# EasyEDA schematic Generic_Agri_Node.json

## Sheets
1 Digital_IO: TITLE: GPIO; REV: 1.0; Date: 2021-01-21; Sheet: 1/1; Drawn By: GoRoNb; Company: agopengps.discourse.group
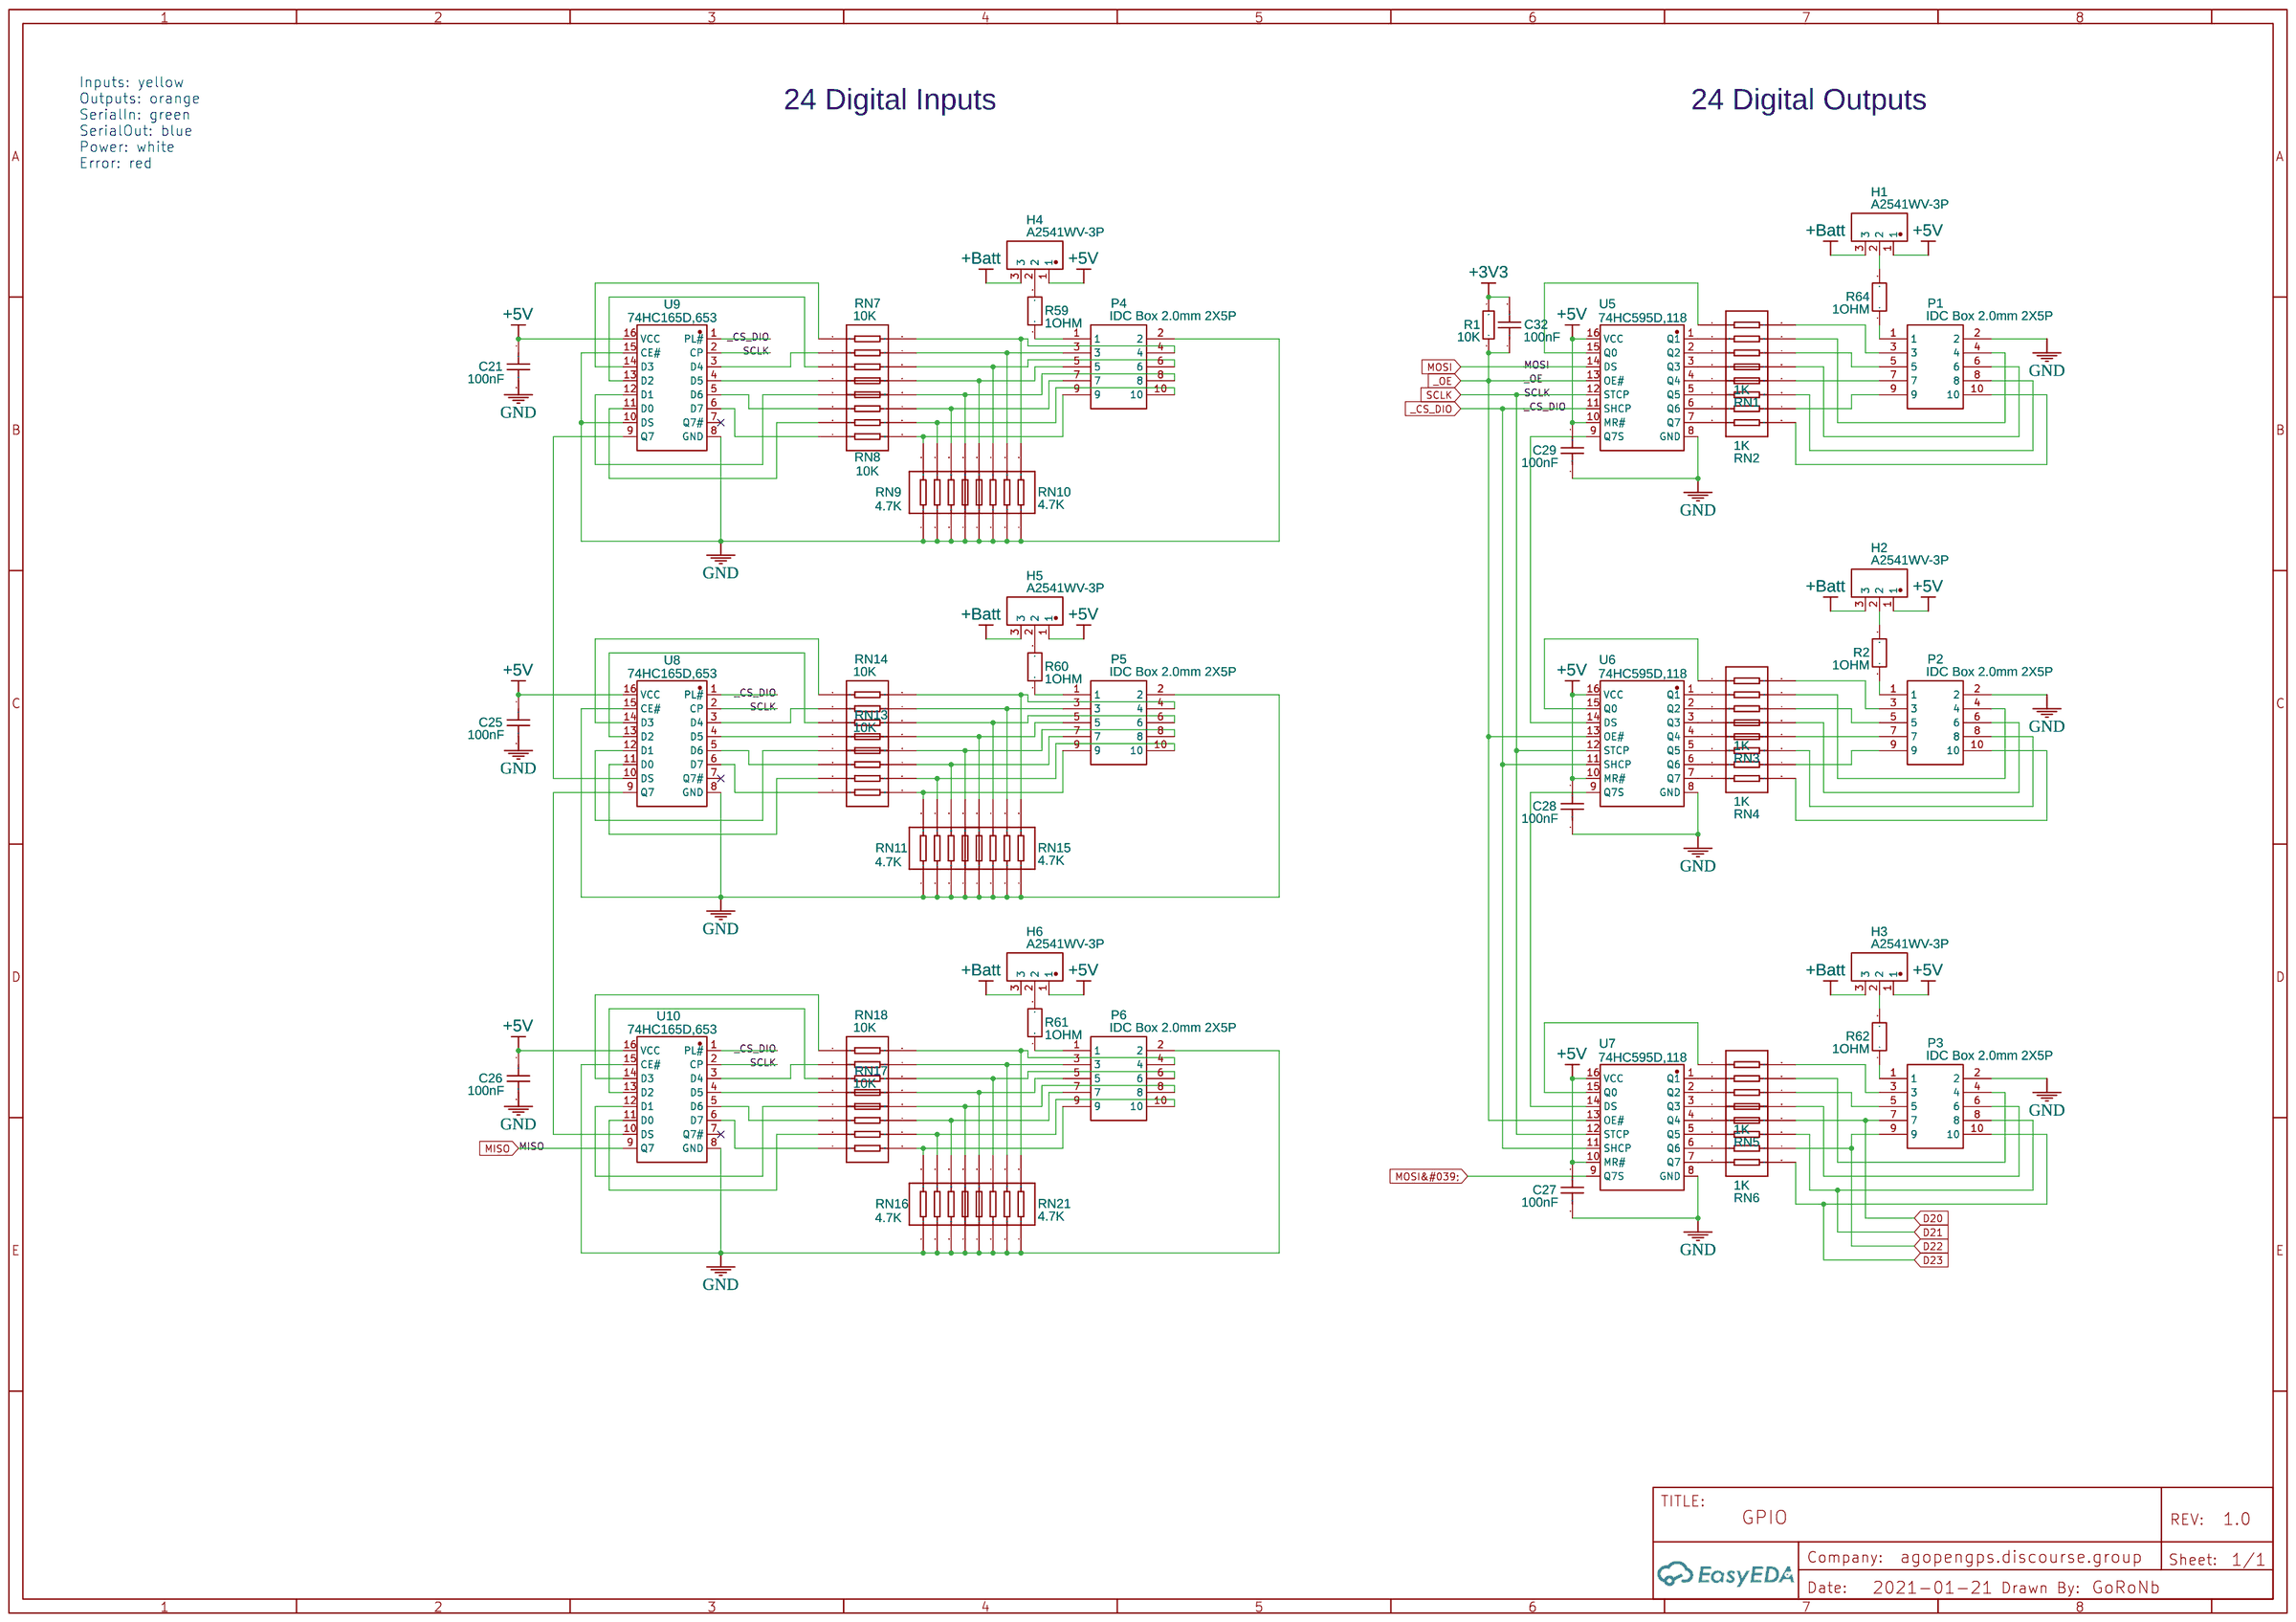
[diagram p0: Digital_IO]
2 Supply_Bus: TITLE: Supply & USB; Date: 2020-12-11
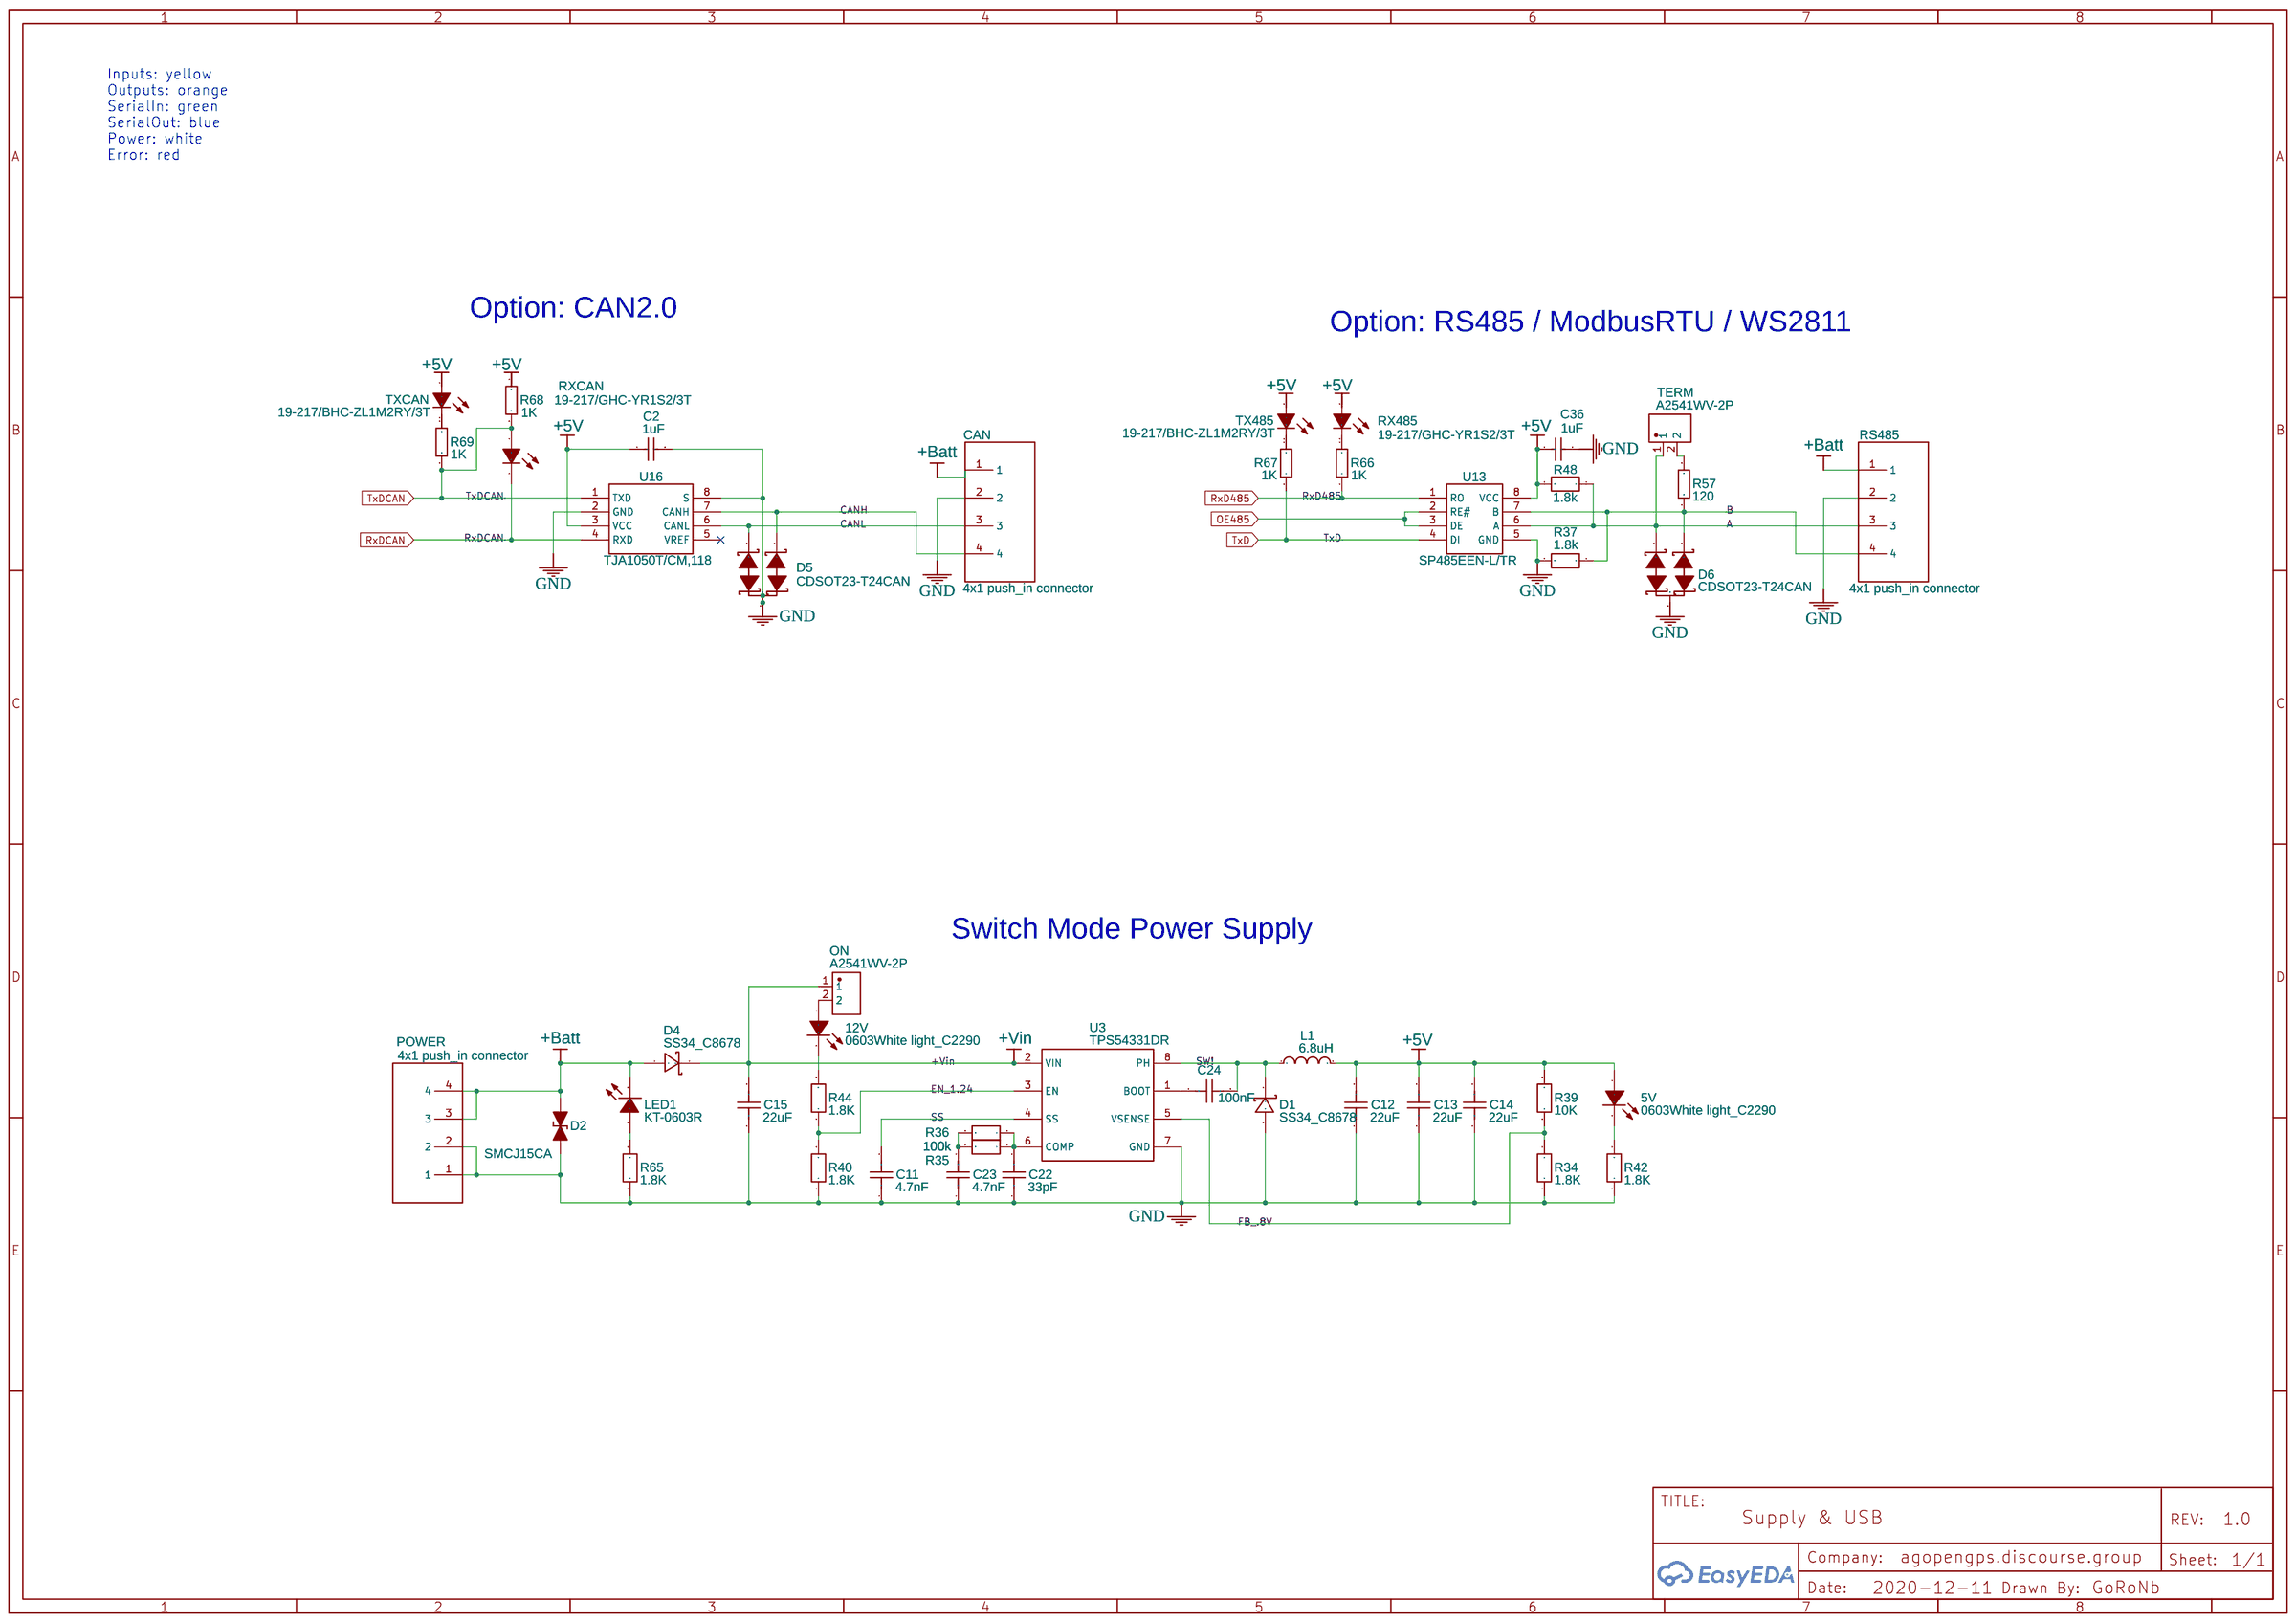
[diagram p1: Supply_Bus]
3 Analog_IO: TITLE: Analog I/O; Date: 2020-12-11
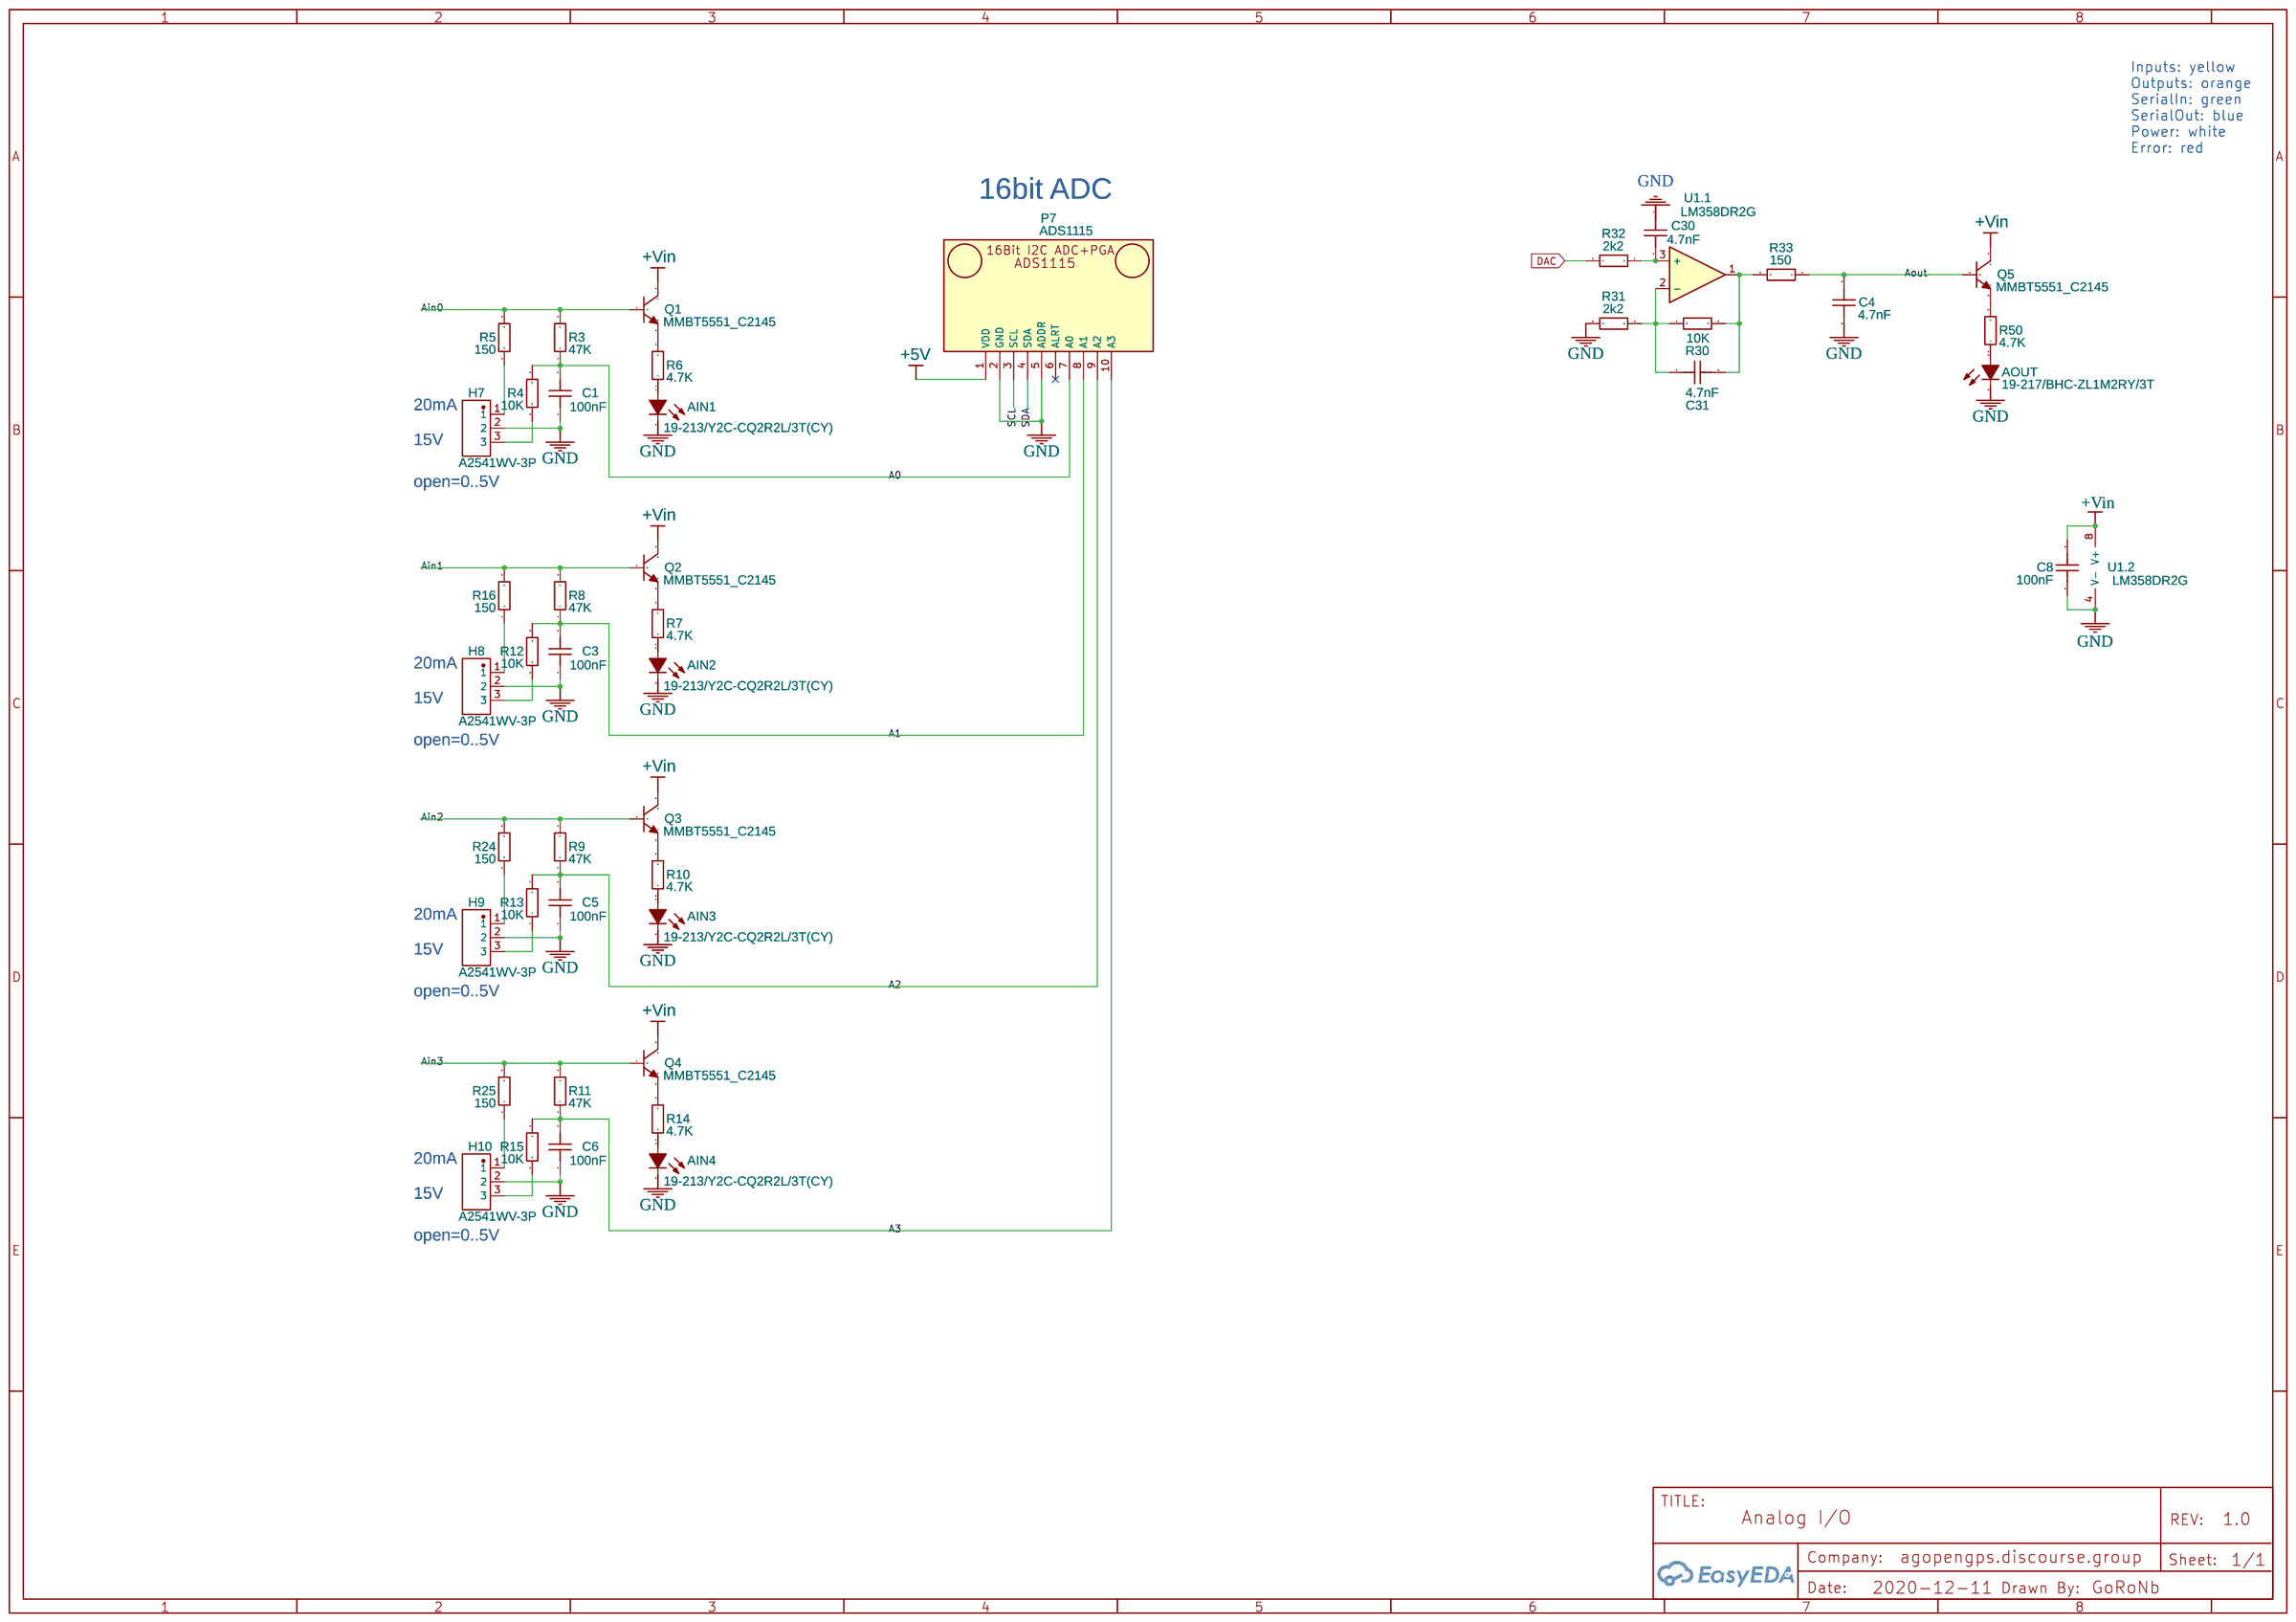
[diagram p2: Analog_IO]
4 Fast_IO: TITLE: Fast digital I/O
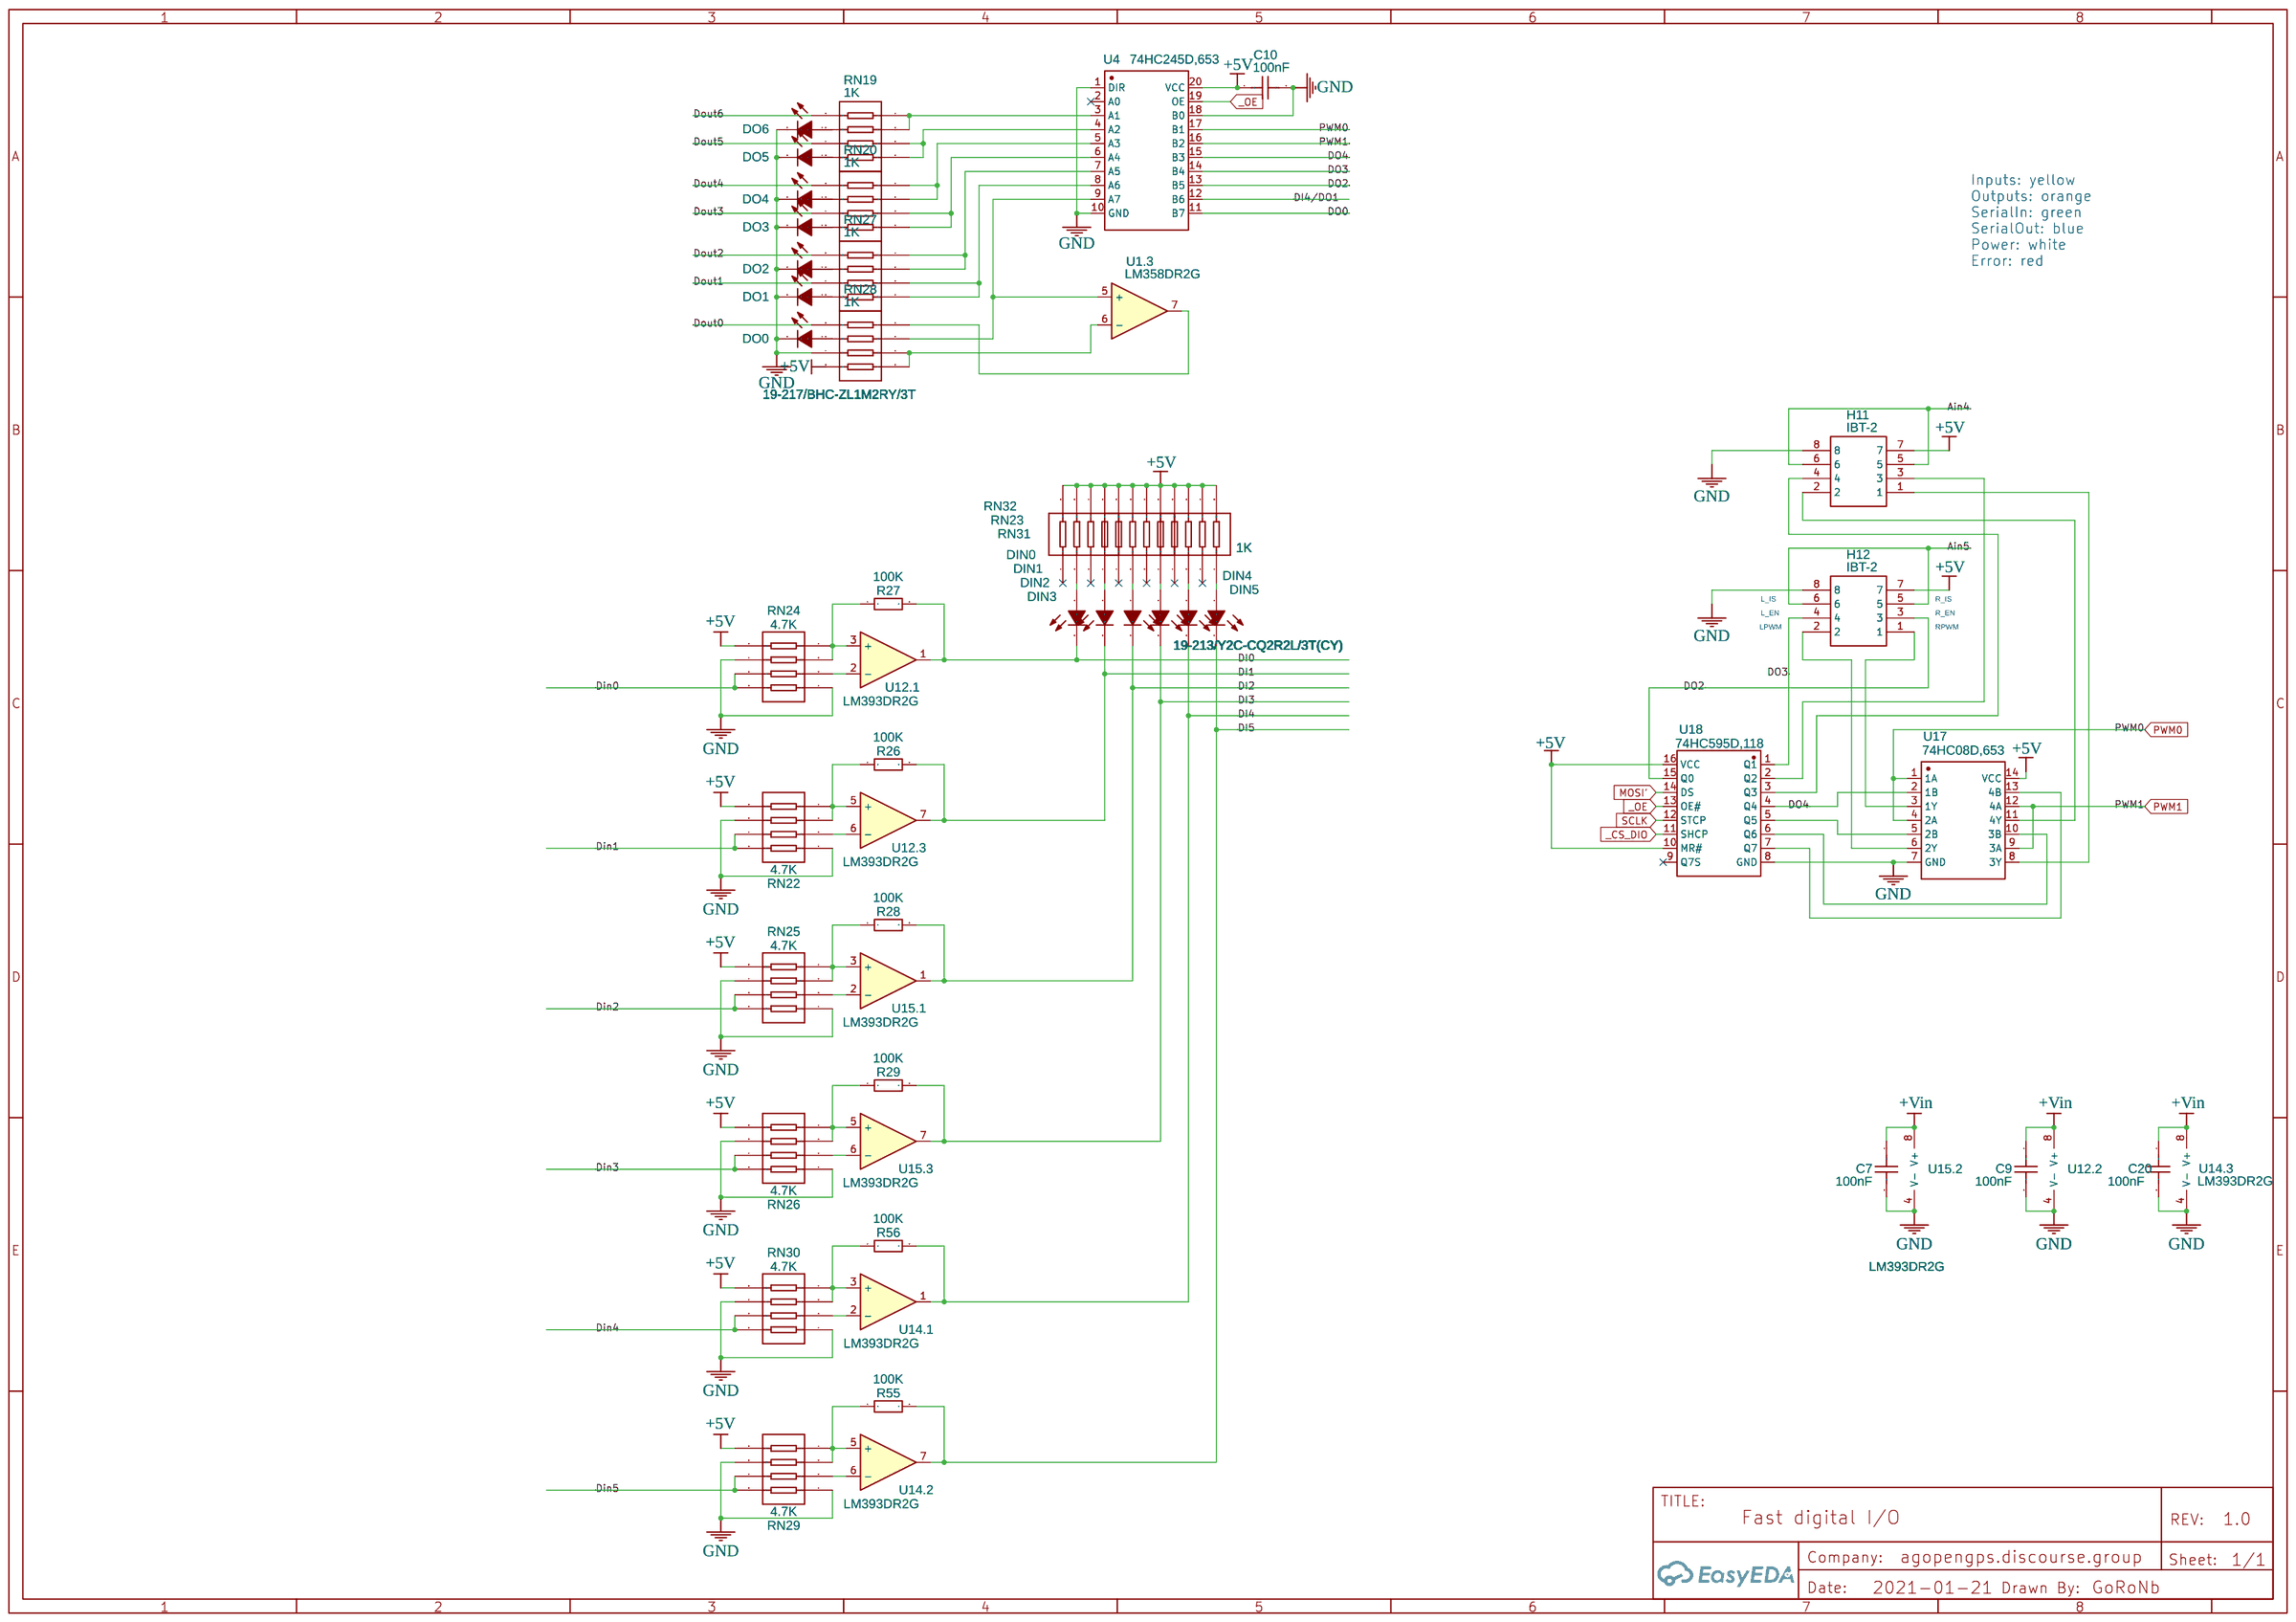
[diagram p3: Fast_IO]
5 Connectors: TITLE: Connectors; Date: 2020-12-11
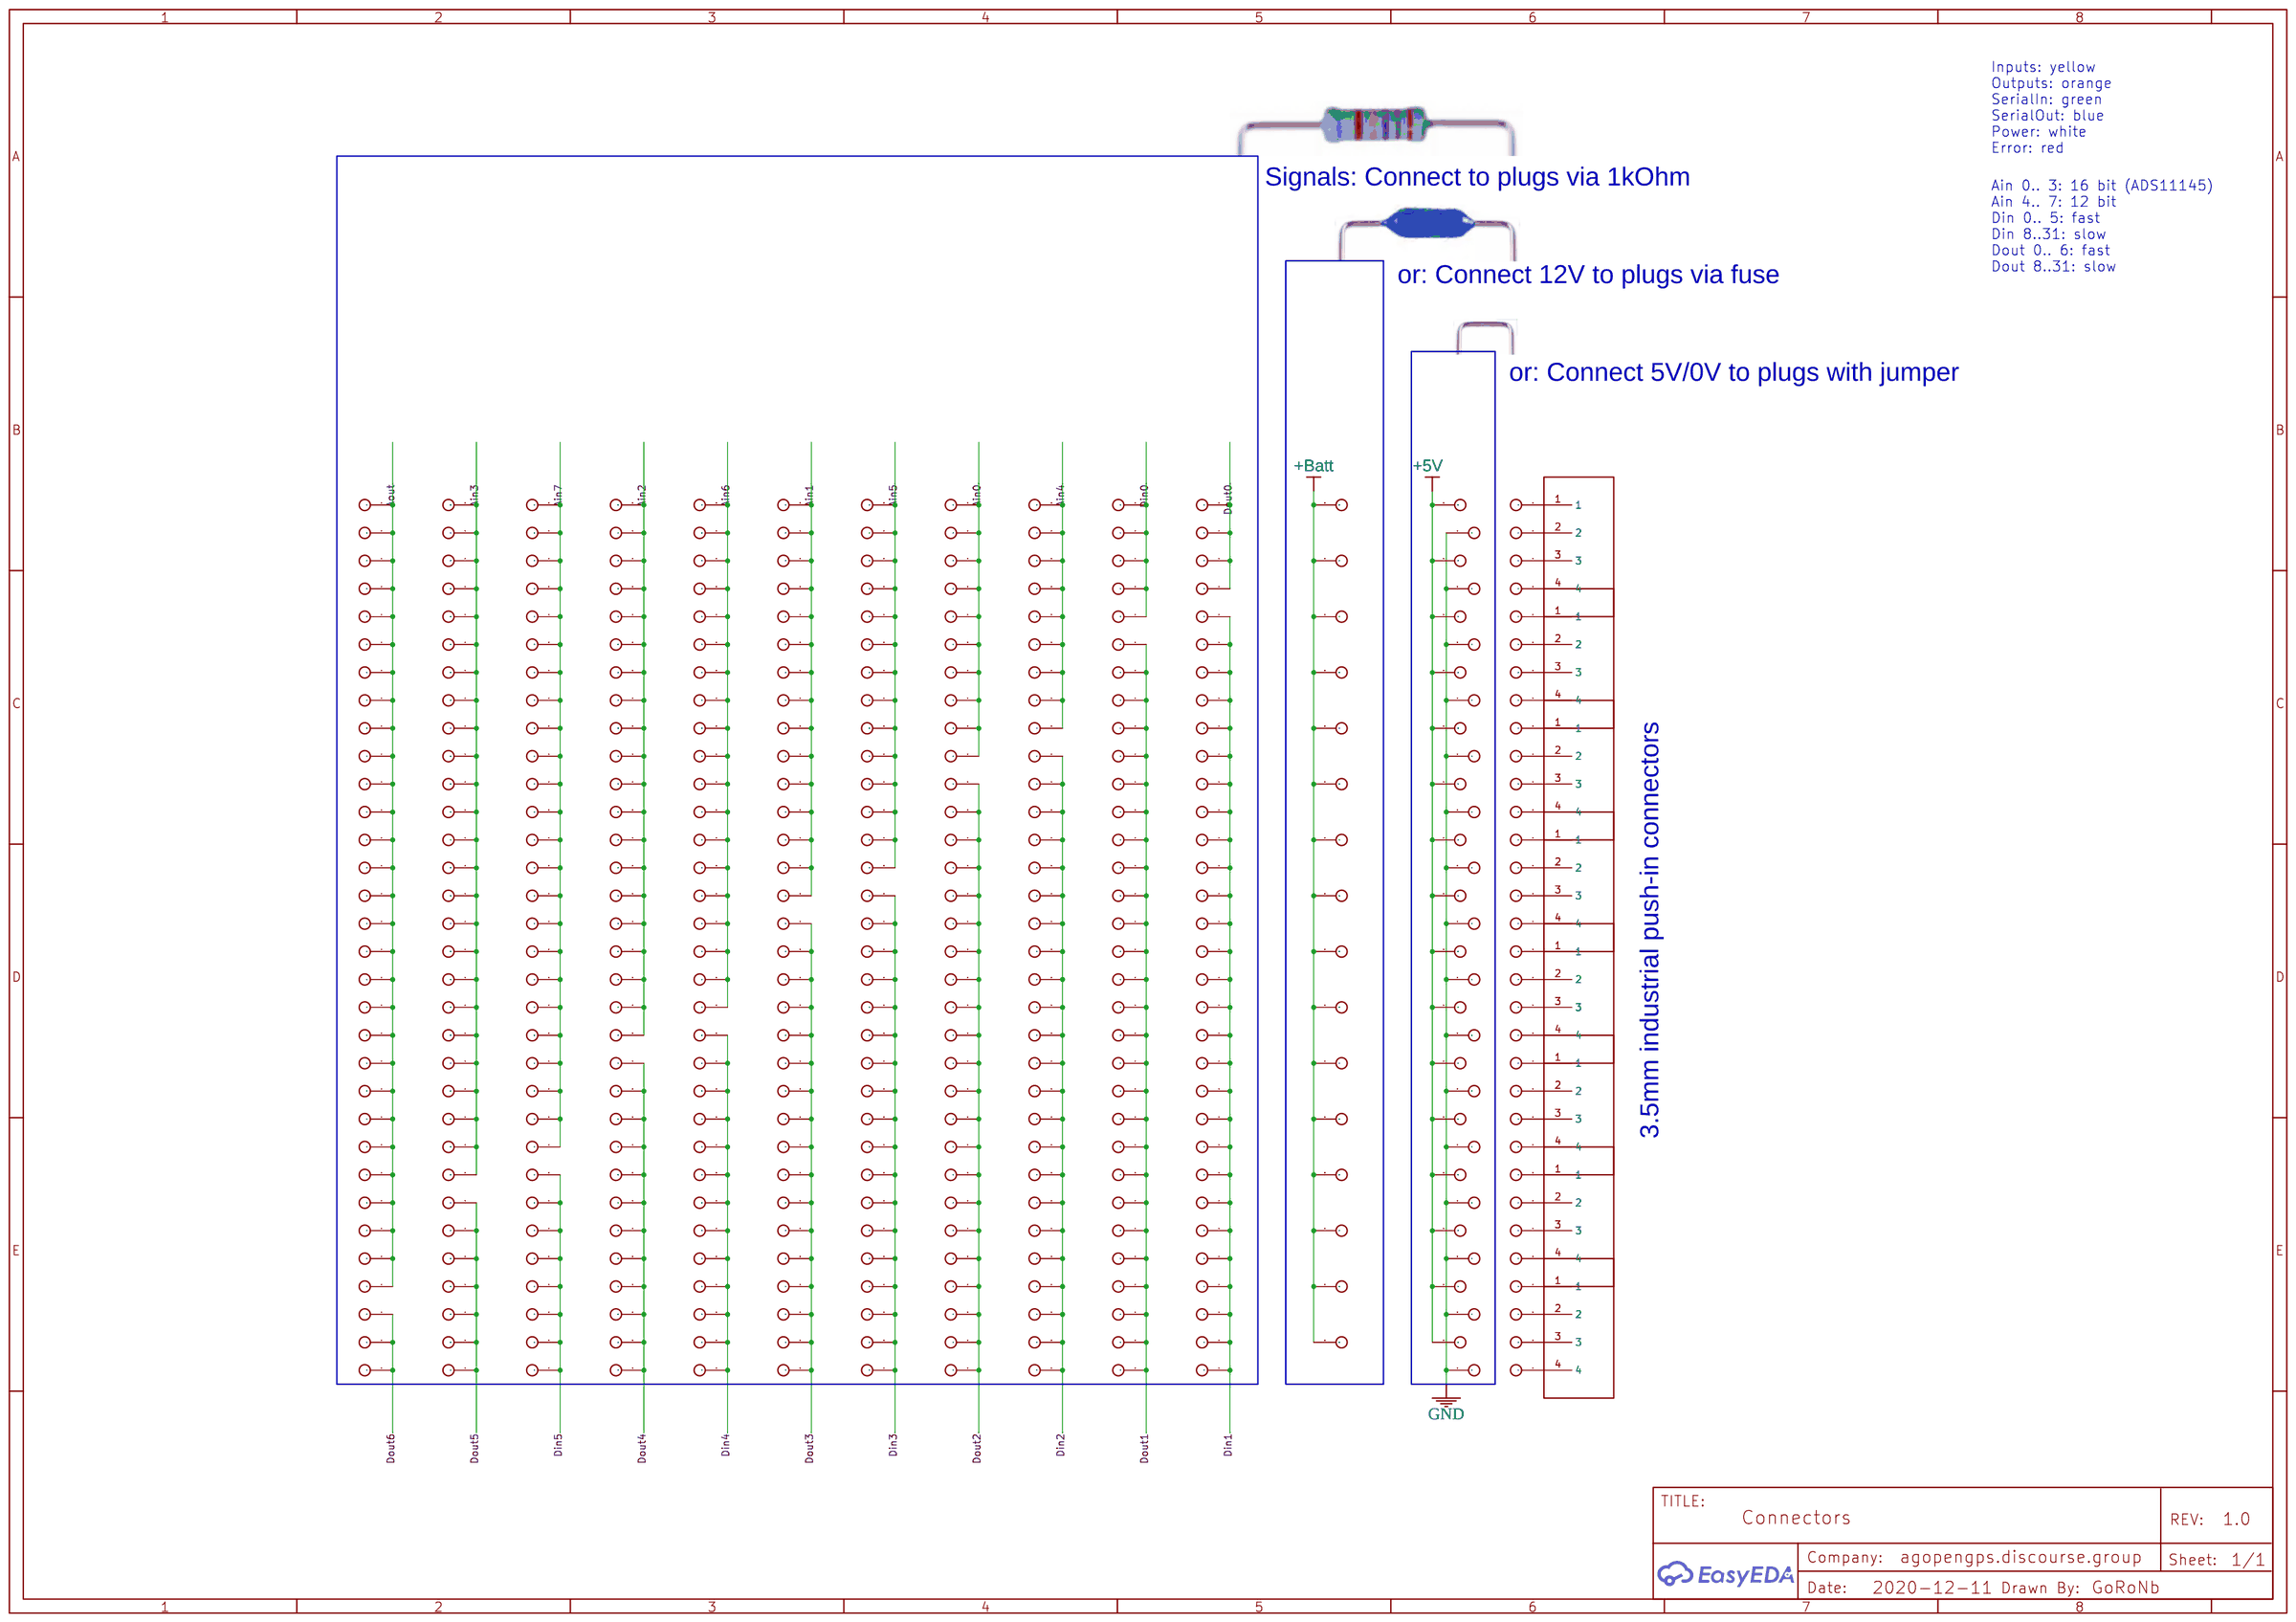
[diagram p4: Connectors]
6 µC: TITLE: µC, modules; Date: 2020-12-11
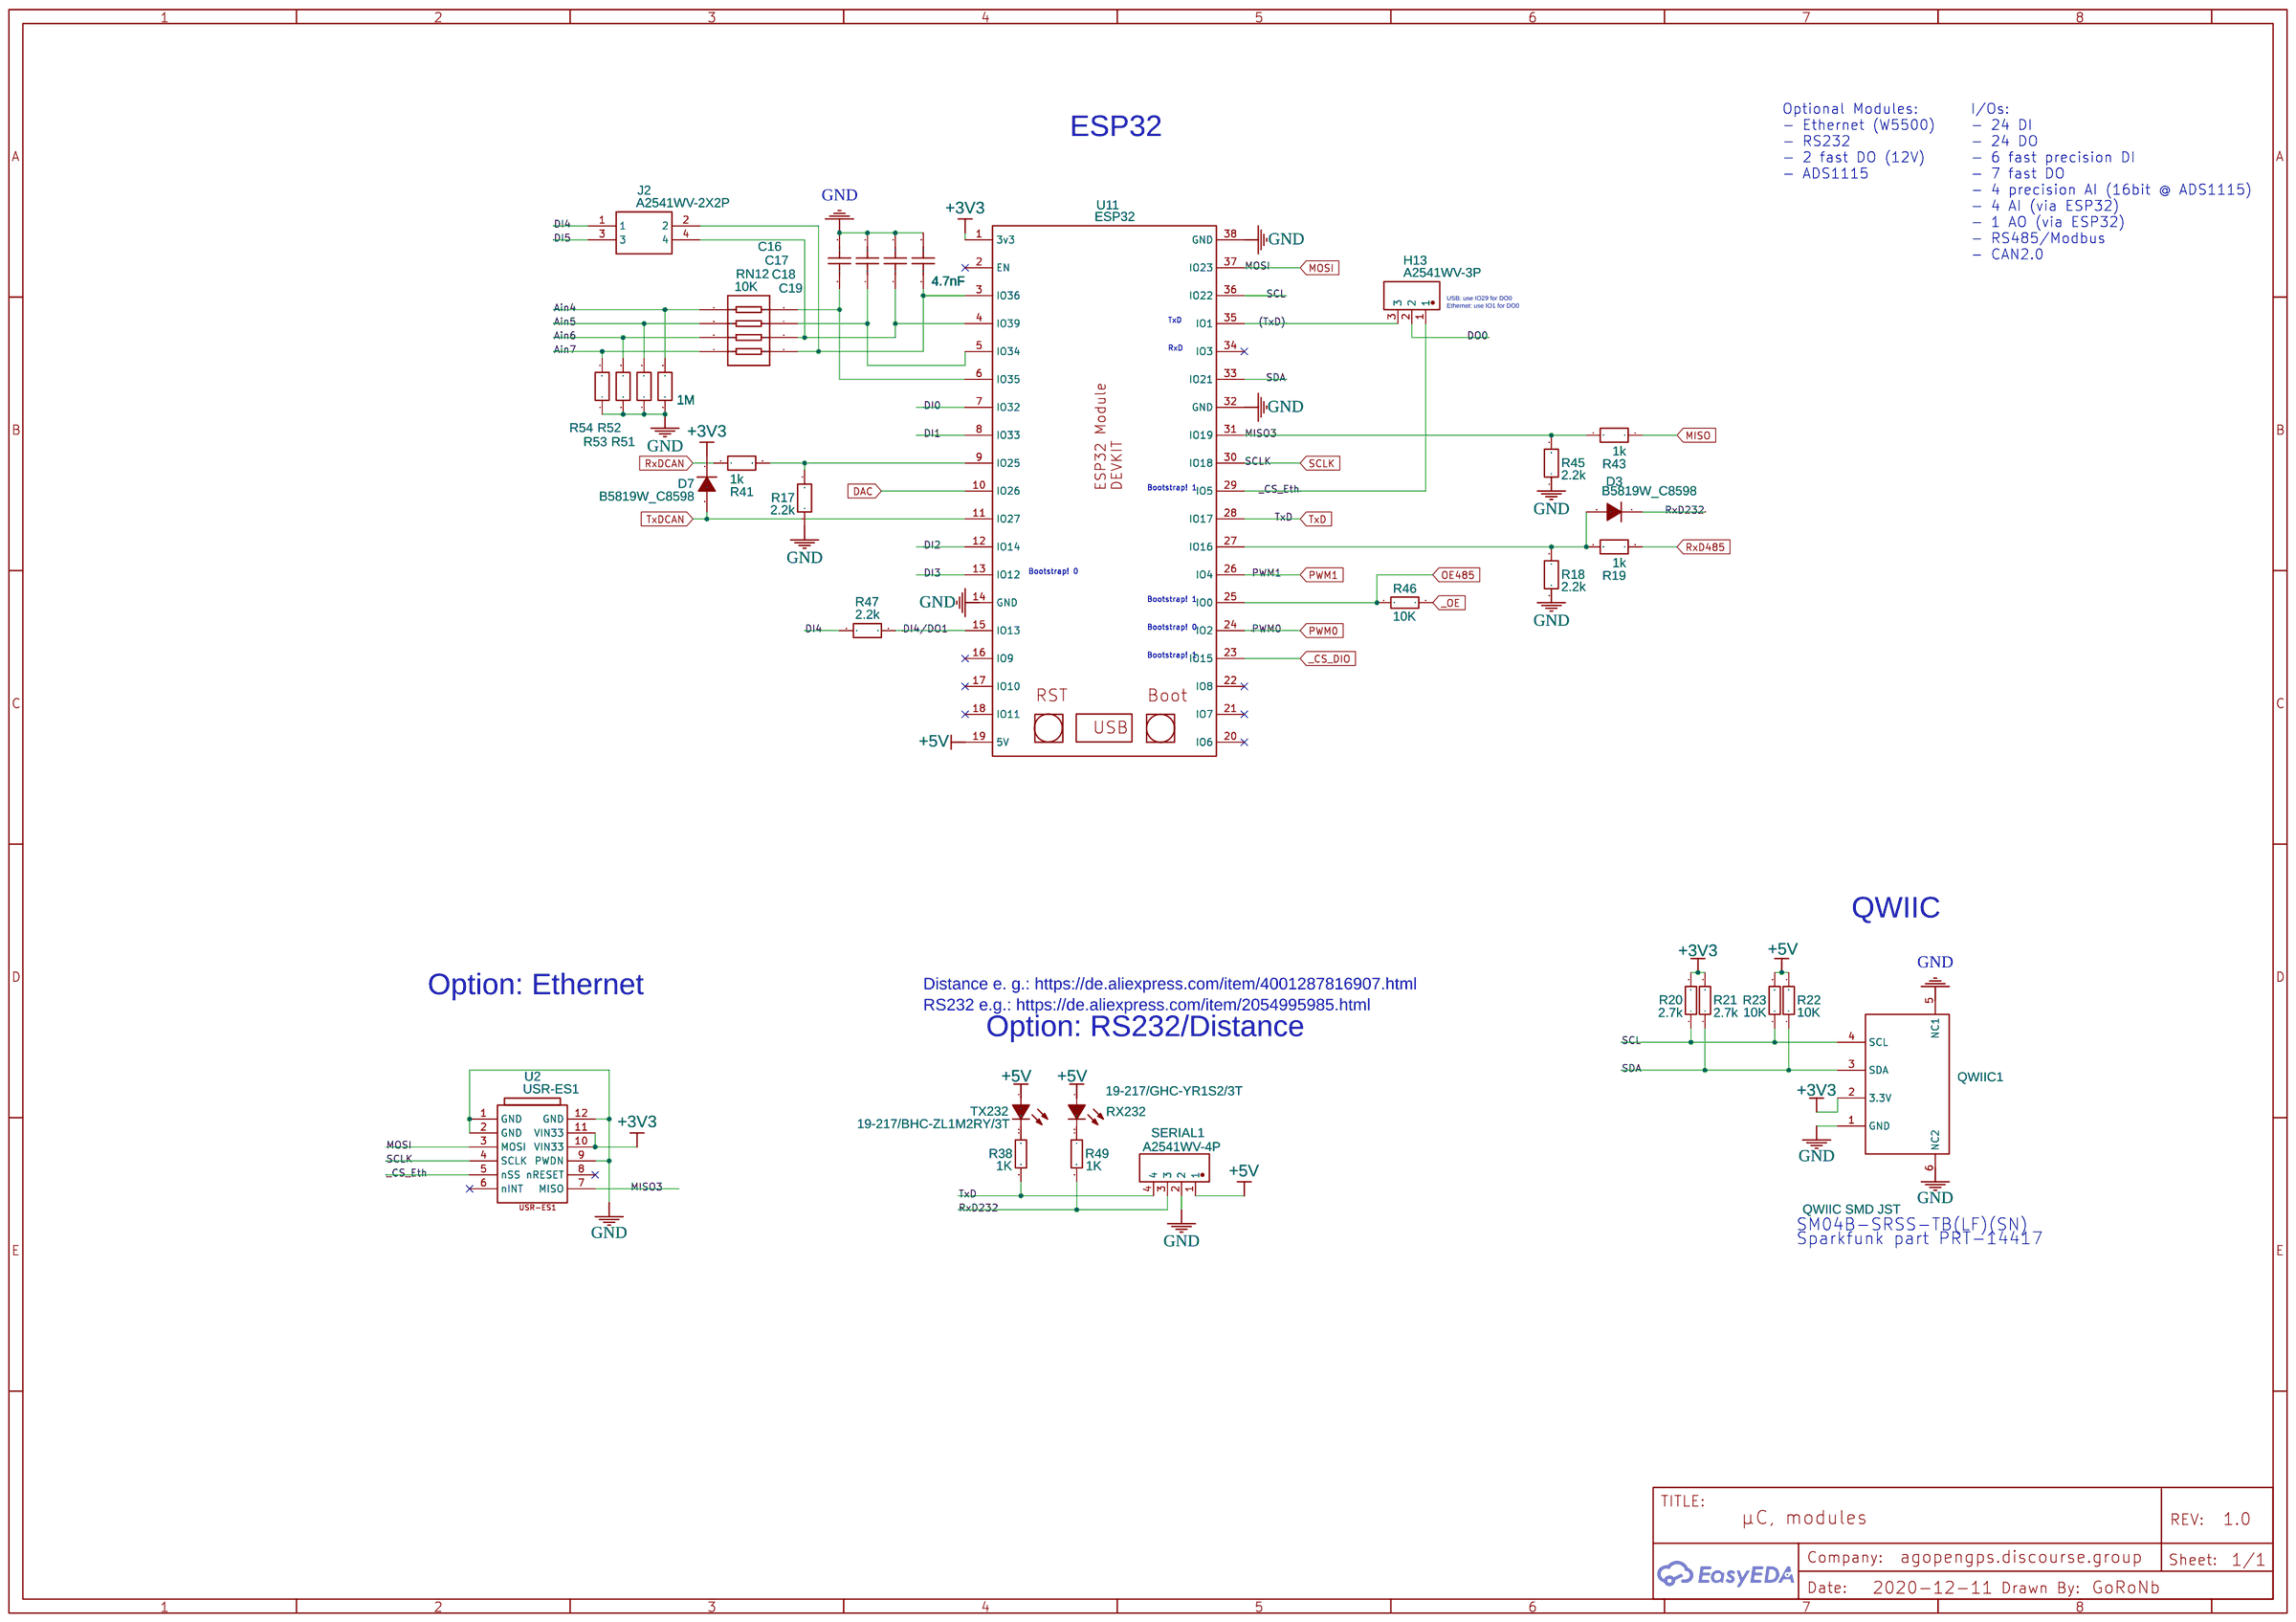
[diagram p5: µC]

## Parts
sheet Analog_IO
AIN1  19-213/Y2C-CQ2R2L/3T(CY)  [LED0603-R-RD]
AIN2  19-213/Y2C-CQ2R2L/3T(CY)  [LED0603-R-RD]
AIN3  19-213/Y2C-CQ2R2L/3T(CY)  [LED0603-R-RD]
AIN4  19-213/Y2C-CQ2R2L/3T(CY)  [LED0603-R-RD]
AOUT  19-217/BHC-ZL1M2RY/3T  [LED0603-R-RD]
C1  100nF  [C0603]
C3  100nF  [C0603]
C4  4.7nF  [C0603]
C5  100nF  [C0603]
C6  100nF  [C0603]
C8  100nF  [C0603]
C30  4.7nF  [C0603]
C31  4.7nF  [C0603]
H7  A2541WV-3P  [HDR-TH_3P-P2.54-V-M]
H8  A2541WV-3P  [HDR-TH_3P-P2.54-V-M]
H9  A2541WV-3P  [HDR-TH_3P-P2.54-V-M]
H10  A2541WV-3P  [HDR-TH_3P-P2.54-V-M]
P7  ADS1115  [ADS1115 BREAKOUT BOARD NO HOLES]
Q1  MMBT5551_C2145  [SOT-23-3_L2.9-W1.3-P1.90-LS2.4-BR]
Q2  MMBT5551_C2145  [SOT-23-3_L2.9-W1.3-P1.90-LS2.4-BR]
Q3  MMBT5551_C2145  [SOT-23-3_L2.9-W1.3-P1.90-LS2.4-BR]
Q4  MMBT5551_C2145  [SOT-23-3_L2.9-W1.3-P1.90-LS2.4-BR]
Q5  MMBT5551_C2145  [SOT-23-3_L2.9-W1.3-P1.90-LS2.4-BR]
R3  47K  [R0603]
R4  10K  [R0603]
R5  150  [R0603]
R6  4.7K  [R0603]
R7  4.7K  [R0603]
R8  47K  [R0603]
R9  47K  [R0603]
R10  4.7K  [R0603]
R11  47K  [R0603]
R12  10K  [R0603]
R13  10K  [R0603]
R14  4.7K  [R0603]
R15  10K  [R0603]
R16  150  [R0603]
R24  150  [R0603]
R25  150  [R0603]
R30  10K  [R0603]
R31  2k2  [R0603]
R32  2k2  [R0603]
R33  150  [R0603]
R50  4.7K  [R0603]
U1  LM358DR2G  [SOIC-8_L5.0-W4.0-P1.27-LS6.0-BL]  (sections 1,2,3)
sheet Connectors
CN3  4x1 push_in connector  [S2C-SMT 3.50/04/180G 3.5SN BK RL]
CN4  4x1 push_in connector  [S2C-SMT 3.50/04/180G 3.5SN BK RL]
CN5  4x1 push_in connector  [S2C-SMT 3.50/04/180G 3.5SN BK RL]
CN6  4x1 push_in connector  [S2C-SMT 3.50/04/180G 3.5SN BK RL]
CN7  4x1 push_in connector  [S2C-SMT 3.50/04/180G 3.5SN BK RL]
CN8  4x1 push_in connector  [S2C-SMT 3.50/04/180G 3.5SN BK RL]
CN9  4x1 push_in connector  [S2C-SMT 3.50/04/180G 3.5SN BK RL]
CN10  4x1 push_in connector  [S2C-SMT 3.50/04/180G 3.5SN BK RL]
TP1  TestPoint  [HDR_1P_WO_SILK]
TP2  TestPoint  [HDR_1P_WO_SILK]
TP3  TestPoint  [HDR_1P_WO_SILK]
TP4  TestPoint  [HDR_1P_WO_SILK]
TP5  TestPoint  [HDR_1P_WO_SILK]
TP6  TestPoint  [HDR_1P_WO_SILK]
TP7  TestPoint  [HDR_1P_WO_SILK]
TP8  TestPoint  [HDR_1P_WO_SILK]
TP9  TestPoint  [HDR_1P_WO_SILK]
TP10  TestPoint  [HDR_1P_WO_SILK]
TP11  TestPoint  [HDR_1P_WO_SILK]
TP12  TestPoint  [HDR_1P_WO_SILK]
TP13  TestPoint  [HDR_1P_WO_SILK]
TP14  TestPoint  [HDR_1P_WO_SILK]
TP15  TestPoint  [HDR_1P_WO_SILK]
TP16  TestPoint  [HDR_1P_WO_SILK]
TP17  TestPoint  [HDR_1P_WO_SILK]
TP18  TestPoint  [HDR_1P_WO_SILK]
TP19  TestPoint  [HDR_1P_WO_SILK]
TP20  TestPoint  [HDR_1P_WO_SILK]
TP21  TestPoint  [HDR_1P_WO_SILK]
TP22  TestPoint  [HDR_1P_WO_SILK]
TP23  TestPoint  [HDR_1P_WO_SILK]
TP24  TestPoint  [HDR_1P_WO_SILK]
TP25  TestPoint  [HDR_1P_WO_SILK]
TP26  TestPoint  [HDR_1P_WO_SILK]
TP27  TestPoint  [HDR_1P_WO_SILK]
TP28  TestPoint  [HDR_1P_WO_SILK]
TP29  TestPoint  [HDR_1P_WO_SILK]
TP30  TestPoint  [HDR_1P_WO_SILK]
TP31  TestPoint  [HDR_1P_WO_SILK]
TP32  TestPoint  [HDR_1P_WO_SILK]
TP33  TestPoint  [HDR_1P_WO_SILK]
TP34  TestPoint  [HDR_1P_1.5_3.9_WO_SILK]
TP35  TestPoint  [HDR_1P_WO_SILK]
TP36  TestPoint  [HDR_1P_1.5_3.9_WO_SILK]
TP37  TestPoint  [HDR_1P_WO_SILK]
TP38  TestPoint  [HDR_1P_1.5_3.9_WO_SILK]
TP39  TestPoint  [HDR_1P_WO_SILK]
TP40  TestPoint  [HDR_1P_1.5_3.9_WO_SILK]
TP41  TestPoint  [HDR_1P_1.5_3.9_WO_SILK]
TP42  TestPoint  [HDR_1P_WO_SILK]
TP43  TestPoint  [HDR_1P_1.5_3.9_WO_SILK]
TP44  TestPoint  [HDR_1P_WO_SILK]
TP45  TestPoint  [HDR_1P_WO_SILK]
TP46  TestPoint  [HDR_1P_1.5_3.9_WO_SILK]
TP47  TestPoint  [HDR_1P_WO_SILK]
TP48  TestPoint  [HDR_1P_1.5_3.9_WO_SILK]
TP49  TestPoint  [HDR_1P_1.5_3.9_WO_SILK]
TP50  TestPoint  [HDR_1P_WO_SILK]
TP51  TestPoint  [HDR_1P_1.5_3.9_WO_SILK]
TP52  TestPoint  [HDR_1P_WO_SILK]
TP53  TestPoint  [HDR_1P_1.5_3.9_WO_SILK]
TP54  TestPoint  [HDR_1P_WO_SILK]
TP55  TestPoint  [HDR_1P_1.5_3.9_WO_SILK]
TP56  TestPoint  [HDR_1P_WO_SILK]
TP57  TestPoint  [HDR_1P_1.5_3.9_WO_SILK]
TP58  TestPoint  [HDR_1P_WO_SILK]
TP59  TestPoint  [HDR_1P_1.5_3.9_WO_SILK]
TP60  TestPoint  [HDR_1P_WO_SILK]
TP61  TestPoint  [HDR_1P_1.5_3.9_WO_SILK]
TP62  TestPoint  [HDR_1P_WO_SILK]
TP63  TestPoint  [HDR_1P_1.5_3.9_WO_SILK]
TP64  TestPoint  [HDR_1P_WO_SILK]
TP65  TestPoint  [HDR_1P_1.5_1.3_WO_SILK]
TP66  TestPoint  [HDR_1P_SMALL_WO_SILK]
TP67  TestPoint  [HDR_1P_1.5_1.3_WO_SILK]
TP68  TestPoint  [HDR_1P_SMALL_WO_SILK]
TP69  TestPoint  [HDR_1P_1.5_1.3_WO_SILK]
TP70  TestPoint  [HDR_1P_SMALL_WO_SILK]
TP71  TestPoint  [HDR_1P_1.5_1.3_WO_SILK]
TP72  TestPoint  [HDR_1P_SMALL_WO_SILK]
TP73  TestPoint  [HDR_1P_SMALL_WO_SILK]
TP74  TestPoint  [HDR_1P_1.5_1.3_WO_SILK]
TP75  TestPoint  [HDR_1P_SMALL_WO_SILK]
TP76  TestPoint  [HDR_1P_1.5_1.3_WO_SILK]
TP77  TestPoint  [HDR_1P_SMALL_WO_SILK]
TP78  TestPoint  [HDR_1P_1.5_1.3_WO_SILK]
TP79  TestPoint  [HDR_1P_SMALL_WO_SILK]
TP80  TestPoint  [HDR_1P_1.5_1.3_WO_SILK]
TP81  TestPoint  [HDR_1P_1.5_1.3_WO_SILK]
TP82  TestPoint  [HDR_1P_SMALL_WO_SILK]
TP83  TestPoint  [HDR_1P_1.5_1.3_WO_SILK]
TP84  TestPoint  [HDR_1P_SMALL_WO_SILK]
TP85  TestPoint  [HDR_1P_1.5_1.3_WO_SILK]
TP86  TestPoint  [HDR_1P_SMALL_WO_SILK]
TP87  TestPoint  [HDR_1P_1.5_1.3_WO_SILK]
TP88  TestPoint  [HDR_1P_SMALL_WO_SILK]
TP89  TestPoint  [HDR_1P_1.5_1.3_WO_SILK]
TP90  TestPoint  [HDR_1P_SMALL_WO_SILK]
TP91  TestPoint  [HDR_1P_1.5_1.3_WO_SILK]
TP92  TestPoint  [HDR_1P_SMALL_WO_SILK]
TP93  TestPoint  [HDR_1P_1.5_1.3_WO_SILK]
TP94  TestPoint  [HDR_1P_SMALL_WO_SILK]
TP95  TestPoint  [HDR_1P_1.5_1.3_WO_SILK]
TP96  TestPoint  [HDR_1P_SMALL_WO_SILK]
TP97  TestPoint  [HDR_1P_SMALL_WO_SILK]
TP98  TestPoint  [HDR_1P_SMALL_WO_SILK]
TP99  TestPoint  [HDR_1P_SMALL_WO_SILK]
TP100  TestPoint  [HDR_1P_SMALL_WO_SILK]
TP101  TestPoint  [HDR_1P_SMALL_WO_SILK]
TP102  TestPoint  [HDR_1P_SMALL_WO_SILK]
TP103  TestPoint  [HDR_1P_SMALL_WO_SILK]
TP104  TestPoint  [HDR_1P_SMALL_WO_SILK]
TP105  TestPoint  [HDR_1P_SMALL_WO_SILK]
TP106  TestPoint  [HDR_1P_SMALL_WO_SILK]
TP107  TestPoint  [HDR_1P_SMALL_WO_SILK]
TP108  TestPoint  [HDR_1P_SMALL_WO_SILK]
TP109  TestPoint  [HDR_1P_SMALL_WO_SILK]
TP110  TestPoint  [HDR_1P_SMALL_WO_SILK]
TP111  TestPoint  [HDR_1P_SMALL_WO_SILK]
TP112  TestPoint  [HDR_1P_SMALL_WO_SILK]
TP113  TestPoint  [HDR_1P_SMALL_WO_SILK]
TP114  TestPoint  [HDR_1P_SMALL_WO_SILK]
TP115  TestPoint  [HDR_1P_SMALL_WO_SILK]
TP116  TestPoint  [HDR_1P_SMALL_WO_SILK]
TP117  TestPoint  [HDR_1P_SMALL_WO_SILK]
TP118  TestPoint  [HDR_1P_SMALL_WO_SILK]
TP119  TestPoint  [HDR_1P_SMALL_WO_SILK]
TP120  TestPoint  [HDR_1P_SMALL_WO_SILK]
TP121  TestPoint  [HDR_1P_SMALL_WO_SILK]
TP122  TestPoint  [HDR_1P_SMALL_WO_SILK]
TP123  TestPoint  [HDR_1P_SMALL_WO_SILK]
TP124  TestPoint  [HDR_1P_SMALL_WO_SILK]
TP125  TestPoint  [HDR_1P_SMALL_WO_SILK]
TP126  TestPoint  [HDR_1P_SMALL_WO_SILK]
TP127  TestPoint  [HDR_1P_SMALL_WO_SILK]
TP128  TestPoint  [HDR_1P_SMALL_WO_SILK]
TP129  TestPoint  [HDR_1P_SMALL_WO_SILK]
TP130  TestPoint  [HDR_1P_SMALL_WO_SILK]
TP131  TestPoint  [HDR_1P_SMALL_WO_SILK]
TP132  TestPoint  [HDR_1P_SMALL_WO_SILK]
TP133  TestPoint  [HDR_1P_SMALL_WO_SILK]
TP134  TestPoint  [HDR_1P_SMALL_WO_SILK]
TP135  TestPoint  [HDR_1P_SMALL_WO_SILK]
TP136  TestPoint  [HDR_1P_SMALL_WO_SILK]
TP137  TestPoint  [HDR_1P_SMALL_WO_SILK]
TP138  TestPoint  [HDR_1P_SMALL_WO_SILK]
TP139  TestPoint  [HDR_1P_SMALL_WO_SILK]
TP140  TestPoint  [HDR_1P_SMALL_WO_SILK]
TP141  TestPoint  [HDR_1P_SMALL_WO_SILK]
TP142  TestPoint  [HDR_1P_SMALL_WO_SILK]
TP143  TestPoint  [HDR_1P_SMALL_WO_SILK]
TP144  TestPoint  [HDR_1P_SMALL_WO_SILK]
TP145  TestPoint  [HDR_1P_SMALL_WO_SILK]
TP146  TestPoint  [HDR_1P_SMALL_WO_SILK]
TP147  TestPoint  [HDR_1P_SMALL_WO_SILK]
TP148  TestPoint  [HDR_1P_SMALL_WO_SILK]
TP149  TestPoint  [HDR_1P_SMALL_WO_SILK]
TP150  TestPoint  [HDR_1P_SMALL_WO_SILK]
TP151  TestPoint  [HDR_1P_SMALL_WO_SILK]
TP152  TestPoint  [HDR_1P_SMALL_WO_SILK]
TP153  TestPoint  [HDR_1P_SMALL_WO_SILK]
TP154  TestPoint  [HDR_1P_SMALL_WO_SILK]
TP155  TestPoint  [HDR_1P_SMALL_WO_SILK]
TP156  TestPoint  [HDR_1P_SMALL_WO_SILK]
TP157  TestPoint  [HDR_1P_SMALL_WO_SILK]
TP158  TestPoint  [HDR_1P_SMALL_WO_SILK]
TP159  TestPoint  [HDR_1P_SMALL_WO_SILK]
TP160  TestPoint  [HDR_1P_SMALL_WO_SILK]
TP161  TestPoint  [HDR_1P_SMALL_WO_SILK]
TP162  TestPoint  [HDR_1P_SMALL_WO_SILK]
TP163  TestPoint  [HDR_1P_SMALL_WO_SILK]
TP164  TestPoint  [HDR_1P_SMALL_WO_SILK]
TP165  TestPoint  [HDR_1P_SMALL_WO_SILK]
TP166  TestPoint  [HDR_1P_SMALL_WO_SILK]
TP167  TestPoint  [HDR_1P_SMALL_WO_SILK]
TP168  TestPoint  [HDR_1P_SMALL_WO_SILK]
TP169  TestPoint  [HDR_1P_SMALL_WO_SILK]
TP170  TestPoint  [HDR_1P_SMALL_WO_SILK]
TP171  TestPoint  [HDR_1P_SMALL_WO_SILK]
TP172  TestPoint  [HDR_1P_SMALL_WO_SILK]
TP173  TestPoint  [HDR_1P_SMALL_WO_SILK]
TP174  TestPoint  [HDR_1P_SMALL_WO_SILK]
TP175  TestPoint  [HDR_1P_SMALL_WO_SILK]
TP176  TestPoint  [HDR_1P_SMALL_WO_SILK]
TP177  TestPoint  [HDR_1P_SMALL_WO_SILK]
TP178  TestPoint  [HDR_1P_SMALL_WO_SILK]
TP179  TestPoint  [HDR_1P_SMALL_WO_SILK]
TP180  TestPoint  [HDR_1P_SMALL_WO_SILK]
TP181  TestPoint  [HDR_1P_SMALL_WO_SILK]
TP182  TestPoint  [HDR_1P_SMALL_WO_SILK]
TP183  TestPoint  [HDR_1P_SMALL_WO_SILK]
TP184  TestPoint  [HDR_1P_SMALL_WO_SILK]
TP185  TestPoint  [HDR_1P_SMALL_WO_SILK]
TP186  TestPoint  [HDR_1P_SMALL_WO_SILK]
TP187  TestPoint  [HDR_1P_SMALL_WO_SILK]
TP188  TestPoint  [HDR_1P_SMALL_WO_SILK]
TP189  TestPoint  [HDR_1P_SMALL_WO_SILK]
TP190  TestPoint  [HDR_1P_SMALL_WO_SILK]
TP191  TestPoint  [HDR_1P_SMALL_WO_SILK]
TP192  TestPoint  [HDR_1P_SMALL_WO_SILK]
TP193  TestPoint  [HDR_1P_SMALL_WO_SILK]
TP194  TestPoint  [HDR_1P_SMALL_WO_SILK]
TP195  TestPoint  [HDR_1P_SMALL_WO_SILK]
TP196  TestPoint  [HDR_1P_SMALL_WO_SILK]
TP197  TestPoint  [HDR_1P_SMALL_WO_SILK]
TP198  TestPoint  [HDR_1P_SMALL_WO_SILK]
TP199  TestPoint  [HDR_1P_SMALL_WO_SILK]
TP200  TestPoint  [HDR_1P_SMALL_WO_SILK]
TP201  TestPoint  [HDR_1P_SMALL_WO_SILK]
TP202  TestPoint  [HDR_1P_SMALL_WO_SILK]
TP203  TestPoint  [HDR_1P_SMALL_WO_SILK]
TP204  TestPoint  [HDR_1P_SMALL_WO_SILK]
TP205  TestPoint  [HDR_1P_SMALL_WO_SILK]
TP206  TestPoint  [HDR_1P_SMALL_WO_SILK]
TP207  TestPoint  [HDR_1P_SMALL_WO_SILK]
TP208  TestPoint  [HDR_1P_SMALL_WO_SILK]
TP209  TestPoint  [HDR_1P_SMALL_WO_SILK]
TP210  TestPoint  [HDR_1P_SMALL_WO_SILK]
TP211  TestPoint  [HDR_1P_SMALL_WO_SILK]
TP212  TestPoint  [HDR_1P_SMALL_WO_SILK]
TP213  TestPoint  [HDR_1P_SMALL_WO_SILK]
TP214  TestPoint  [HDR_1P_SMALL_WO_SILK]
TP215  TestPoint  [HDR_1P_SMALL_WO_SILK]
TP216  TestPoint  [HDR_1P_SMALL_WO_SILK]
TP217  TestPoint  [HDR_1P_SMALL_WO_SILK]
TP218  TestPoint  [HDR_1P_SMALL_WO_SILK]
TP219  TestPoint  [HDR_1P_SMALL_WO_SILK]
TP220  TestPoint  [HDR_1P_SMALL_WO_SILK]
TP221  TestPoint  [HDR_1P_SMALL_WO_SILK]
TP222  TestPoint  [HDR_1P_SMALL_WO_SILK]
TP223  TestPoint  [HDR_1P_SMALL_WO_SILK]
TP224  TestPoint  [HDR_1P_SMALL_WO_SILK]
TP225  TestPoint  [HDR_1P_SMALL_WO_SILK]
TP226  TestPoint  [HDR_1P_SMALL_WO_SILK]
TP227  TestPoint  [HDR_1P_SMALL_WO_SILK]
TP228  TestPoint  [HDR_1P_SMALL_WO_SILK]
TP229  TestPoint  [HDR_1P_SMALL_WO_SILK]
TP230  TestPoint  [HDR_1P_SMALL_WO_SILK]
TP231  TestPoint  [HDR_1P_SMALL_WO_SILK]
TP232  TestPoint  [HDR_1P_SMALL_WO_SILK]
TP233  TestPoint  [HDR_1P_SMALL_WO_SILK]
TP234  TestPoint  [HDR_1P_SMALL_WO_SILK]
TP235  TestPoint  [HDR_1P_SMALL_WO_SILK]
TP236  TestPoint  [HDR_1P_SMALL_WO_SILK]
TP237  TestPoint  [HDR_1P_SMALL_WO_SILK]
TP238  TestPoint  [HDR_1P_SMALL_WO_SILK]
TP239  TestPoint  [HDR_1P_SMALL_WO_SILK]
TP240  TestPoint  [HDR_1P_SMALL_WO_SILK]
TP241  TestPoint  [HDR_1P_SMALL_WO_SILK]
TP242  TestPoint  [HDR_1P_SMALL_WO_SILK]
TP243  TestPoint  [HDR_1P_SMALL_WO_SILK]
TP244  TestPoint  [HDR_1P_SMALL_WO_SILK]
TP245  TestPoint  [HDR_1P_SMALL_WO_SILK]
TP246  TestPoint  [HDR_1P_SMALL_WO_SILK]
TP247  TestPoint  [HDR_1P_SMALL_WO_SILK]
TP248  TestPoint  [HDR_1P_SMALL_WO_SILK]
TP249  TestPoint  [HDR_1P_SMALL_WO_SILK]
TP250  TestPoint  [HDR_1P_SMALL_WO_SILK]
TP251  TestPoint  [HDR_1P_SMALL_WO_SILK]
TP252  TestPoint  [HDR_1P_SMALL_WO_SILK]
TP253  TestPoint  [HDR_1P_SMALL_WO_SILK]
TP254  TestPoint  [HDR_1P_SMALL_WO_SILK]
TP255  TestPoint  [HDR_1P_SMALL_WO_SILK]
TP256  TestPoint  [HDR_1P_SMALL_WO_SILK]
TP257  TestPoint  [HDR_1P_SMALL_WO_SILK]
TP258  TestPoint  [HDR_1P_SMALL_WO_SILK]
TP259  TestPoint  [HDR_1P_SMALL_WO_SILK]
TP260  TestPoint  [HDR_1P_SMALL_WO_SILK]
TP261  TestPoint  [HDR_1P_SMALL_WO_SILK]
TP262  TestPoint  [HDR_1P_SMALL_WO_SILK]
TP263  TestPoint  [HDR_1P_SMALL_WO_SILK]
TP264  TestPoint  [HDR_1P_SMALL_WO_SILK]
TP265  TestPoint  [HDR_1P_SMALL_WO_SILK]
TP266  TestPoint  [HDR_1P_SMALL_WO_SILK]
TP267  TestPoint  [HDR_1P_SMALL_WO_SILK]
TP268  TestPoint  [HDR_1P_SMALL_WO_SILK]
TP269  TestPoint  [HDR_1P_SMALL_WO_SILK]
TP270  TestPoint  [HDR_1P_SMALL_WO_SILK]
TP271  TestPoint  [HDR_1P_SMALL_WO_SILK]
TP272  TestPoint  [HDR_1P_SMALL_WO_SILK]
TP273  TestPoint  [HDR_1P_SMALL_WO_SILK]
TP274  TestPoint  [HDR_1P_SMALL_WO_SILK]
TP275  TestPoint  [HDR_1P_SMALL_WO_SILK]
TP276  TestPoint  [HDR_1P_SMALL_WO_SILK]
TP277  TestPoint  [HDR_1P_SMALL_WO_SILK]
TP278  TestPoint  [HDR_1P_SMALL_WO_SILK]
TP279  TestPoint  [HDR_1P_SMALL_WO_SILK]
TP280  TestPoint  [HDR_1P_SMALL_WO_SILK]
TP281  TestPoint  [HDR_1P_SMALL_WO_SILK]
TP282  TestPoint  [HDR_1P_SMALL_WO_SILK]
TP283  TestPoint  [HDR_1P_SMALL_WO_SILK]
TP284  TestPoint  [HDR_1P_SMALL_WO_SILK]
TP285  TestPoint  [HDR_1P_SMALL_WO_SILK]
TP286  TestPoint  [HDR_1P_SMALL_WO_SILK]
TP287  TestPoint  [HDR_1P_SMALL_WO_SILK]
TP288  TestPoint  [HDR_1P_SMALL_WO_SILK]
TP289  TestPoint  [HDR_1P_SMALL_WO_SILK]
TP290  TestPoint  [HDR_1P_SMALL_WO_SILK]
TP291  TestPoint  [HDR_1P_SMALL_WO_SILK]
TP292  TestPoint  [HDR_1P_SMALL_WO_SILK]
TP293  TestPoint  [HDR_1P_SMALL_WO_SILK]
TP294  TestPoint  [HDR_1P_SMALL_WO_SILK]
TP295  TestPoint  [HDR_1P_SMALL_WO_SILK]
TP296  TestPoint  [HDR_1P_SMALL_WO_SILK]
TP297  TestPoint  [HDR_1P_SMALL_WO_SILK]
TP298  TestPoint  [HDR_1P_SMALL_WO_SILK]
TP299  TestPoint  [HDR_1P_SMALL_WO_SILK]
TP300  TestPoint  [HDR_1P_SMALL_WO_SILK]
TP301  TestPoint  [HDR_1P_SMALL_WO_SILK]
TP302  TestPoint  [HDR_1P_SMALL_WO_SILK]
TP303  TestPoint  [HDR_1P_SMALL_WO_SILK]
TP304  TestPoint  [HDR_1P_SMALL_WO_SILK]
TP305  TestPoint  [HDR_1P_SMALL_WO_SILK]
TP306  TestPoint  [HDR_1P_SMALL_WO_SILK]
TP307  TestPoint  [HDR_1P_SMALL_WO_SILK]
TP308  TestPoint  [HDR_1P_SMALL_WO_SILK]
TP309  TestPoint  [HDR_1P_SMALL_WO_SILK]
TP310  TestPoint  [HDR_1P_SMALL_WO_SILK]
TP311  TestPoint  [HDR_1P_SMALL_WO_SILK]
TP312  TestPoint  [HDR_1P_SMALL_WO_SILK]
TP313  TestPoint  [HDR_1P_SMALL_WO_SILK]
TP314  TestPoint  [HDR_1P_SMALL_WO_SILK]
TP315  TestPoint  [HDR_1P_SMALL_WO_SILK]
TP316  TestPoint  [HDR_1P_SMALL_WO_SILK]
TP317  TestPoint  [HDR_1P_SMALL_WO_SILK]
TP318  TestPoint  [HDR_1P_SMALL_WO_SILK]
TP319  TestPoint  [HDR_1P_SMALL_WO_SILK]
TP320  TestPoint  [HDR_1P_SMALL_WO_SILK]
TP321  TestPoint  [HDR_1P_SMALL_WO_SILK]
TP322  TestPoint  [HDR_1P_SMALL_WO_SILK]
TP323  TestPoint  [HDR_1P_SMALL_WO_SILK]
TP324  TestPoint  [HDR_1P_SMALL_WO_SILK]
TP325  TestPoint  [HDR_1P_SMALL_WO_SILK]
TP326  TestPoint  [HDR_1P_SMALL_WO_SILK]
TP327  TestPoint  [HDR_1P_SMALL_WO_SILK]
TP328  TestPoint  [HDR_1P_SMALL_WO_SILK]
TP329  TestPoint  [HDR_1P_SMALL_WO_SILK]
TP330  TestPoint  [HDR_1P_SMALL_WO_SILK]
TP331  TestPoint  [HDR_1P_SMALL_WO_SILK]
TP332  TestPoint  [HDR_1P_SMALL_WO_SILK]
TP333  TestPoint  [HDR_1P_SMALL_WO_SILK]
TP334  TestPoint  [HDR_1P_SMALL_WO_SILK]
TP335  TestPoint  [HDR_1P_SMALL_WO_SILK]
TP336  TestPoint  [HDR_1P_SMALL_WO_SILK]
TP337  TestPoint  [HDR_1P_SMALL_WO_SILK]
TP338  TestPoint  [HDR_1P_SMALL_WO_SILK]
TP339  TestPoint  [HDR_1P_SMALL_WO_SILK]
TP340  TestPoint  [HDR_1P_SMALL_WO_SILK]
TP341  TestPoint  [HDR_1P_SMALL_WO_SILK]
TP342  TestPoint  [HDR_1P_SMALL_WO_SILK]
TP343  TestPoint  [HDR_1P_SMALL_WO_SILK]
TP344  TestPoint  [HDR_1P_SMALL_WO_SILK]
TP345  TestPoint  [HDR_1P_SMALL_WO_SILK]
TP346  TestPoint  [HDR_1P_SMALL_WO_SILK]
TP347  TestPoint  [HDR_1P_SMALL_WO_SILK]
TP348  TestPoint  [HDR_1P_SMALL_WO_SILK]
TP349  TestPoint  [HDR_1P_SMALL_WO_SILK]
TP350  TestPoint  [HDR_1P_SMALL_WO_SILK]
TP351  TestPoint  [HDR_1P_SMALL_WO_SILK]
TP352  TestPoint  [HDR_1P_SMALL_WO_SILK]
TP353  TestPoint  [HDR_1P_SMALL_WO_SILK]
TP354  TestPoint  [HDR_1P_SMALL_WO_SILK]
TP355  TestPoint  [HDR_1P_SMALL_WO_SILK]
TP356  TestPoint  [HDR_1P_SMALL_WO_SILK]
TP357  TestPoint  [HDR_1P_SMALL_WO_SILK]
TP358  TestPoint  [HDR_1P_SMALL_WO_SILK]
TP359  TestPoint  [HDR_1P_SMALL_WO_SILK]
TP360  TestPoint  [HDR_1P_SMALL_WO_SILK]
TP361  TestPoint  [HDR_1P_SMALL_WO_SILK]
TP362  TestPoint  [HDR_1P_SMALL_WO_SILK]
TP363  TestPoint  [HDR_1P_SMALL_WO_SILK]
TP364  TestPoint  [HDR_1P_SMALL_WO_SILK]
TP365  TestPoint  [HDR_1P_SMALL_WO_SILK]
TP366  TestPoint  [HDR_1P_SMALL_WO_SILK]
TP367  TestPoint  [HDR_1P_SMALL_WO_SILK]
TP368  TestPoint  [HDR_1P_SMALL_WO_SILK]
TP401  TestPoint  [HDR_1P_SMALL_WO_SILK]
TP402  TestPoint  [HDR_1P_SMALL_WO_SILK]
TP403  TestPoint  [HDR_1P_SMALL_WO_SILK]
TP404  TestPoint  [HDR_1P_SMALL_WO_SILK]
TP405  TestPoint  [HDR_1P_SMALL_WO_SILK]
TP406  TestPoint  [HDR_1P_SMALL_WO_SILK]
TP407  TestPoint  [HDR_1P_SMALL_WO_SILK]
TP408  TestPoint  [HDR_1P_SMALL_WO_SILK]
TP409  TestPoint  [HDR_1P_SMALL_WO_SILK]
TP410  TestPoint  [HDR_1P_SMALL_WO_SILK]
TP411  TestPoint  [HDR_1P_SMALL_WO_SILK]
TP412  TestPoint  [HDR_1P_SMALL_WO_SILK]
TP413  TestPoint  [HDR_1P_SMALL_WO_SILK]
TP414  TestPoint  [HDR_1P_SMALL_WO_SILK]
TP415  TestPoint  [HDR_1P_SMALL_WO_SILK]
TP416  TestPoint  [HDR_1P_SMALL_WO_SILK]
TP417  TestPoint  [HDR_1P_SMALL_WO_SILK]
TP418  TestPoint  [HDR_1P_SMALL_WO_SILK]
TP419  TestPoint  [HDR_1P_SMALL_WO_SILK]
TP420  TestPoint  [HDR_1P_SMALL_WO_SILK]
TP421  TestPoint  [HDR_1P_SMALL_WO_SILK]
TP422  TestPoint  [HDR_1P_SMALL_WO_SILK]
TP423  TestPoint  [HDR_1P_SMALL_WO_SILK]
TP424  TestPoint  [HDR_1P_SMALL_WO_SILK]
TP425  TestPoint  [HDR_1P_SMALL_WO_SILK]
TP426  TestPoint  [HDR_1P_SMALL_WO_SILK]
TP427  TestPoint  [HDR_1P_SMALL_WO_SILK]
TP428  TestPoint  [HDR_1P_SMALL_WO_SILK]
TP429  TestPoint  [HDR_1P_SMALL_WO_SILK]
TP430  TestPoint  [HDR_1P_SMALL_WO_SILK]
TP431  TestPoint  [HDR_1P_SMALL_WO_SILK]
TP432  TestPoint  [HDR_1P_SMALL_WO_SILK]
TP433  TestPoint  [HDR_1P_SMALL_WO_SILK]
TP434  TestPoint  [HDR_1P_SMALL_WO_SILK]
TP435  TestPoint  [HDR_1P_SMALL_WO_SILK]
TP436  TestPoint  [HDR_1P_SMALL_WO_SILK]
TP437  TestPoint  [HDR_1P_SMALL_WO_SILK]
TP438  TestPoint  [HDR_1P_SMALL_WO_SILK]
TP439  TestPoint  [HDR_1P_SMALL_WO_SILK]
TP440  TestPoint  [HDR_1P_SMALL_WO_SILK]
TP441  TestPoint  [HDR_1P_SMALL_WO_SILK]
TP442  TestPoint  [HDR_1P_SMALL_WO_SILK]
TP443  TestPoint  [HDR_1P_SMALL_WO_SILK]
TP444  TestPoint  [HDR_1P_SMALL_WO_SILK]
TP445  TestPoint  [HDR_1P_SMALL_WO_SILK]
TP446  TestPoint  [HDR_1P_SMALL_WO_SILK]
TP447  TestPoint  [HDR_1P_SMALL_WO_SILK]
TP448  TestPoint  [HDR_1P_SMALL_WO_SILK]
TP449  TestPoint  [HDR_1P_SMALL_WO_SILK]
TP450  TestPoint  [HDR_1P_SMALL_WO_SILK]
TP451  TestPoint  [HDR_1P_SMALL_WO_SILK]
TP452  TestPoint  [HDR_1P_SMALL_WO_SILK]
TP453  TestPoint  [HDR_1P_SMALL_WO_SILK]
TP454  TestPoint  [HDR_1P_SMALL_WO_SILK]
TP455  TestPoint  [HDR_1P_SMALL_WO_SILK]
TP456  TestPoint  [HDR_1P_SMALL_WO_SILK]
TP457  TestPoint  [HDR_1P_SMALL_WO_SILK]
TP458  TestPoint  [HDR_1P_SMALL_WO_SILK]
TP459  TestPoint  [HDR_1P_SMALL_WO_SILK]
TP460  TestPoint  [HDR_1P_SMALL_WO_SILK]
TP461  TestPoint  [HDR_1P_SMALL_WO_SILK]
TP462  TestPoint  [HDR_1P_SMALL_WO_SILK]
TP463  TestPoint  [HDR_1P_SMALL_WO_SILK]
TP464  TestPoint  [HDR_1P_SMALL_WO_SILK]
sheet Digital_IO
C21  100nF  [C0603]
C25  100nF  [C0603]
C26  100nF  [C0603]
C27  100nF  [C0603]
C28  100nF  [C0603]
C29  100nF  [C0603]
C32  100nF  [C0603]
H1  A2541WV-3P  [HDR-TH_3P-P2.54-V-M]
H2  A2541WV-3P  [HDR-TH_3P-P2.54-V-M]
H3  A2541WV-3P  [HDR-TH_3P-P2.54-V-M]
H4  A2541WV-3P  [HDR-TH_3P-P2.54-V-M]
H5  A2541WV-3P  [HDR-TH_3P-P2.54-V-M]
H6  A2541WV-3P  [HDR-TH_3P-P2.54-V-M]
P1  IDC Box 2.0mm 2X5P  [IDC-TH_10P-P2.00-V-R2-C5-S2.00]
P2  IDC Box 2.0mm 2X5P  [IDC-TH_10P-P2.00-V-R2-C5-S2.00]
P3  IDC Box 2.0mm 2X5P  [IDC-TH_10P-P2.00-V-R2-C5-S2.00]
P4  IDC Box 2.0mm 2X5P  [IDC-TH_10P-P2.00-V-R2-C5-S2.00]
P5  IDC Box 2.0mm 2X5P  [IDC-TH_10P-P2.00-V-R2-C5-S2.00]
P6  IDC Box 2.0mm 2X5P  [IDC-TH_10P-P2.00-V-R2-C5-S2.00]
R1  10K  [R0603]
R2  1OHM  [R0603]
R59  1OHM  [R0603]
R60  1OHM  [R0603]
R61  1OHM  [R0603]
R62  1OHM  [R0603]
R64  1OHM  [R0603]
RN1  1K  [RES-ARRAY-SMD_0603-8P-L3.2-W1.6-BL]
RN2  1K  [RES-ARRAY-SMD_0603-8P-L3.2-W1.6-BL]
RN3  1K  [RES-ARRAY-SMD_0603-8P-L3.2-W1.6-BL]
RN4  1K  [RES-ARRAY-SMD_0603-8P-L3.2-W1.6-BL]
RN5  1K  [RES-ARRAY-SMD_0603-8P-L3.2-W1.6-BL]
RN6  1K  [RES-ARRAY-SMD_0603-8P-L3.2-W1.6-BL]
RN7  10K  [RES-ARRAY-SMD_0603-8P-L3.2-W1.6-BL]
RN8  10K  [RES-ARRAY-SMD_0603-8P-L3.2-W1.6-BL]
RN9  4.7K  [RES-ARRAY-SMD_0603-8P-L3.2-W1.6-BL]
RN10  4.7K  [RES-ARRAY-SMD_0603-8P-L3.2-W1.6-BL]
RN11  4.7K  [RES-ARRAY-SMD_0603-8P-L3.2-W1.6-BL]
RN13  10K  [RES-ARRAY-SMD_0603-8P-L3.2-W1.6-BL]
RN14  10K  [RES-ARRAY-SMD_0603-8P-L3.2-W1.6-BL]
RN15  4.7K  [RES-ARRAY-SMD_0603-8P-L3.2-W1.6-BL]
RN16  4.7K  [RES-ARRAY-SMD_0603-8P-L3.2-W1.6-BL]
RN17  10K  [RES-ARRAY-SMD_0603-8P-L3.2-W1.6-BL]
RN18  10K  [RES-ARRAY-SMD_0603-8P-L3.2-W1.6-BL]
RN21  4.7K  [RES-ARRAY-SMD_0603-8P-L3.2-W1.6-BL]
U5  74HC595D,118  [SOIC-16_L9.9-W3.9-P1.27-LS6.0-BL]
U6  74HC595D,118  [SOIC-16_L9.9-W3.9-P1.27-LS6.0-BL]
U7  74HC595D,118  [SOIC-16_L9.9-W3.9-P1.27-LS6.0-BL]
U8  74HC165D,653  [SOIC-16_L9.9-W3.9-P1.27-LS6.0-BL]
U9  74HC165D,653  [SOIC-16_L9.9-W3.9-P1.27-LS6.0-BL]
U10  74HC165D,653  [SOIC-16_L9.9-W3.9-P1.27-LS6.0-BL]
sheet Fast_IO
C7  100nF  [C0603]
C9  100nF  [C0603]
C10  100nF  [C0603]
C20  100nF  [C0603]
DIN0  19-213/Y2C-CQ2R2L/3T(CY)  [LED0603-R-RD]
DIN1  19-213/Y2C-CQ2R2L/3T(CY)  [LED0603-R-RD]
DIN2  19-213/Y2C-CQ2R2L/3T(CY)  [LED0603-R-RD]
DIN3  19-213/Y2C-CQ2R2L/3T(CY)  [LED0603-R-RD]
DIN4  19-213/Y2C-CQ2R2L/3T(CY)  [LED0603-R-RD]
DIN5  19-213/Y2C-CQ2R2L/3T(CY)  [LED0603-R-RD]
DO0  19-217/BHC-ZL1M2RY/3T  [LED0603-R-RD]
DO1  19-217/BHC-ZL1M2RY/3T  [LED0603-R-RD]
DO2  19-217/BHC-ZL1M2RY/3T  [LED0603-R-RD]
DO3  19-217/BHC-ZL1M2RY/3T  [LED0603-R-RD]
DO4  19-217/BHC-ZL1M2RY/3T  [LED0603-R-RD]
DO5  19-217/BHC-ZL1M2RY/3T  [LED0603-R-RD]
DO6  19-217/BHC-ZL1M2RY/3T  [LED0603-R-RD]
H11  IBT-2  [HDR-TH_8P-P2.54-V-R2-C4-S2.54_A2541WV-2X4P]
H12  IBT-2  [HDR-TH_8P-P2.54-V-R2-C4-S2.54_A2541WV-2X4P]
R26  100K  [R0603]
R27  100K  [R0603]
R28  100K  [R0603]
R29  100K  [R0603]
R55  100K  [R0603]
R56  100K  [R0603]
RN19  1K  [RES-ARRAY-SMD_0603-8P-L3.2-W1.6-BL]
RN20  1K  [RES-ARRAY-SMD_0603-8P-L3.2-W1.6-BL]
RN22  4.7K  [RES-ARRAY-SMD_0603-8P-L3.2-W1.6-BL]
RN23  1K  [RES-ARRAY-SMD_0603-8P-L3.2-W1.6-BL]
RN24  4.7K  [RES-ARRAY-SMD_0603-8P-L3.2-W1.6-BL]
RN25  4.7K  [RES-ARRAY-SMD_0603-8P-L3.2-W1.6-BL]
RN26  4.7K  [RES-ARRAY-SMD_0603-8P-L3.2-W1.6-BL]
RN27  1K  [RES-ARRAY-SMD_0603-8P-L3.2-W1.6-BL]
RN28  1K  [RES-ARRAY-SMD_0603-8P-L3.2-W1.6-BL]
RN29  4.7K  [RES-ARRAY-SMD_0603-8P-L3.2-W1.6-BL]
RN30  4.7K  [RES-ARRAY-SMD_0603-8P-L3.2-W1.6-BL]
RN31  1K  [RES-ARRAY-SMD_0603-8P-L3.2-W1.6-BL]
RN32  1K  [RES-ARRAY-SMD_0603-8P-L3.2-W1.6-BL]
U4  74HC245D,653  [SOIC-20_L13.0-W7.6-P1.27-LS10.6-BL]
U12  LM393DR2G  [SOIC-8_L5.0-W4.0-P1.27-LS6.0-BL]  (sections 1,2,3)
U14  LM393DR2G  [SOIC-8_L5.0-W4.0-P1.27-LS6.0-BL]  (sections 1,2,3)
U15  LM393DR2G  [SOIC-8_L5.0-W4.0-P1.27-LS6.0-BL]  (sections 1,2,3)
U17  74HC08D,653  [SOIC-14_L8.7-W3.9-P1.27-LS6.0-BL]
U18  74HC595D,118  [SOIC-16_L9.9-W3.9-P1.27-LS6.0-BL]
sheet Supply_Bus
5V  0603White light_C2290  [LED0603-R-RD]
12V  0603White light_C2290  [LED0603-R-RD]
C2  1uF  [C0603]
C11  4.7nF  [C0603]
C12  22uF  [C0603]
C13  22uF  [C0603]
C14  22uF  [C0603]
C15  22uF  [C0805]
C22  33pF  [C0603]
C23  4.7nF  [C0603]
C24  100nF  [C0603]
C36  1uF  [C0603]
CAN  4x1 push_in connector  [S2C-SMT 3.50/04/180G 3.5SN BK RL]
D1  SS34_C8678  [DO-214AC_L4.3-W2.7-LS5.3-RD]
D2  SMCJ15CA  [SMC_L6.9-W5.9-LS7.9-BI]
D4  SS34_C8678  [DO-214AC_L4.3-W2.7-LS5.3-RD]
D5  CDSOT23-T24CAN  [SOT-23_L2.9-W1.3-P0.95-LS2.4-BR]
D6  CDSOT23-T24CAN  [SOT-23_L2.9-W1.3-P0.95-LS2.4-BR]
L1  6.8uH  [IND-SMD_L6.0-W6.0_SWPA6045S]
LED1  KT-0603R  [LED0603-R-RD]
ON  A2541WV-2P  [HDR-TH_P2.54-H-M_A2541WV-2P]
POWER  4x1 push_in connector  [S2C-SMT 3.50/04/180G 3.5SN BK RL]
R34  1.8K  [R0603]
R35  100k  [R0603]
R36  100k  [R0603]
R37  1.8k  [R0603]
R39  10K  [R0603]
R40  1.8K  [R0603]
R42  1.8K  [R0603]
R44  1.8K  [R0603]
R48  1.8k  [R0603]
R57  120  [R0805]
R65  1.8K  [R0603]
R66  1K  [R0603]
R67  1K  [R0603]
R68  1K  [R0603]
R69  1K  [R0603]
RS485  4x1 push_in connector  [S2C-SMT 3.50/04/180G 3.5SN BK RL]
RX485  19-217/GHC-YR1S2/3T  [LED0603-R-RD]
RXCAN  19-217/GHC-YR1S2/3T  [LED0603-R-RD]
TERM  A2541WV-2P  [HDR-TH_P2.54-H-M_A2541WV-2P]
TX485  19-217/BHC-ZL1M2RY/3T  [LED0603-R-RD]
TXCAN  19-217/BHC-ZL1M2RY/3T  [LED0603-R-RD]
U3  TPS54331DR  [SOIC-8_L5.0-W4.0-P1.27-LS6.0-BL]
U13  SP485EEN-L/TR  [SOIC-8_L5.0-W4.0-P1.27-LS6.0-BL]
U16  TJA1050T/CM,118  [SOIC-8_L5.0-W4.0-P1.27-LS6.0-BL]
sheet µC
C16  4.7nF  [C0603]
C17  4.7nF  [C0603]
C18  4.7nF  [C0603]
C19  4.7nF  [C0603]
D3  B5819W_C8598  [SOD-123_L2.8-W1.8-LS3.7-RD]
D7  B5819W_C8598  [SOD-123_L2.8-W1.8-LS3.7-RD]
H13  A2541WV-3P  [HDR-TH_3P-P2.54-V-M]
J2  A2541WV-2X2P  [HDR-TH_4P-P2.54-V-R2-C2-S2.54_A2541WV-2X2P]
QWIIC1  QWIIC SMD JST  [QWIIC CONNECTOR]
R17  2.2k  [R0603]
R18  2.2k  [R0603]
R19  1k  [R0603]
R20  2.7k  [R0603]
R21  2.7k  [R0603]
R22  10K  [R0603]
R23  10K  [R0603]
R38  1K  [R0603]
R41  1k  [R0603]
R43  1k  [R0603]
R45  2.2k  [R0603]
R46  10K  [R0603]
R47  2.2k  [R0603]
R49  1K  [R0603]
R51  1M  [R0603]
R52  1M  [R0603]
R53  1M  [R0603]
R54  1M  [R0603]
RN12  10K  [RES-ARRAY-SMD_0603-8P-L3.2-W1.6-BL]
RX232  19-217/GHC-YR1S2/3T  [LED0603-R-RD]
SERIAL1  A2541WV-4P  [HDR-TH_4P-P2.54-V]
TX232  19-217/BHC-ZL1M2RY/3T  [LED0603-R-RD]
U2  USR-ES1  [USR-ES1]
U11  ESP32  [AZ-DELIVERY NODEMCU ESP32 DEV KIT]

## Library data of the parts
AIN1-AIN4 DIN0-DIN5 = 19-213/Y2C-CQ2R2L/3T(CY): Supplier: LCSC; Manufacturer: EVERLIGHT; image: //image.lceda.cn/szlcsc/C72038.jpg; Supplier Part: C72038; SMT Type: Basic; JLCPCB SMD: Yes; LCSC Assembly: Yes
AOUT DO0-DO6 TX232 TX485 TXCAN = 19-217/BHC-ZL1M2RY/3T: Supplier: LCSC; Manufacturer: EVERLIGHT; image: //image.lceda.cn/szlcsc/C72041.jpg; Supplier Part: C72041; SMT Type: Basic; JLCPCB SMD: Yes; LCSC Assembly: Yes
C1 C3 C5-C10 C20 C21 C25-C29 = CC0603JRX7R8BB104: Supplier: LCSC; Supplier Part: C327087; Manufacturer: YAGEO; Contributor: LCSC
C4 C11 C16-C19 C22-C24 C30-C32 = C_0603_US: Contributor: LCEDA_Lib
H1-H10 H13 = A2541WV-3P: Supplier: LCSC; Supplier Part: C225478; Manufacturer: Changjiang Connectors; Contributor: LCSC; LCSC Assembly: Yes; SMT Type: Extend
P7 = ADS1115: sourceId: 1T5FDZYC8
Q1-Q5 = MMBT5551_C2145: Supplier: LCSC; Manufacturer: CJ; Manufacturer Part: MMBT5551; image: //image.lceda.cn/szlcsc/C2145.jpg; Supplier Part: C2145; SMT Type: Basic; JLCPCB SMD: Yes; LCSC Assembly: Yes
R3 R6-R11 R14 R50 = 0603WAF4701T5E: Supplier: LCSC; Manufacturer: UniOhm; Supplier Part: C23162; SMT Type: Basic; JLCPCB SMD: Yes; LCSC Assembly: Yes
R4 R12 R13 R15 R22 R23 R30 R46 = 0603WAF1002T5E: Supplier: LCSC; Manufacturer: UniOhm; Supplier Part: C25804; SMT Type: Basic; JLCPCB SMD: Yes; LCSC Assembly: Yes
R5 R16 R24 R25 R33 = 0603WAF1500T5E: Supplier: LCSC; Manufacturer: UniOhm; Supplier Part: C22808; SMT Type: Basic; JLCPCB SMD: Yes; LCSC Assembly: Yes
R20 R21 R31 R32 = RTT03100JTP: Supplier: LCSC; Manufacturer: RALEC; Manufacturer Part: RTT03222JTP; Supplier Part: C103203
U1 = LM358-Amplifier_Operational-ARU-rescue: Contributor: Михаил Кузнецов; subpart_no: 1; Supplier Part: C7950; Supplier: LCSC; Manufacturer: ON
CAN CN3-CN10 POWER RS485 = 4x1 push_in connector: Manufacturer: Weidmuller; Manufacturer Part: 1825660000; Supplier: Digi-Key; Supplier Part: 281-2044-ND; link: https://www.digikey.ca/product-detail/en/weidmuller/1825660000/281-2044-ND/1094382; Contributor: Renaud Varin
TP1-TP368 TP401-TP464 = TestPoint: Contributor: subseapark
P1-P6 = IDC Box 2.0mm 2X5P: Supplier: LCSC; Manufacturer: BOOMELE; image: //image.lceda.cn/szlcsc/C5661.jpg; Supplier Part: C5661; LCSC Assembly: Yes; SMT Type: Extend
R1 = RTT03103JTP: Supplier: LCSC; Manufacturer: RALEC; Supplier Part: C103210
R2 R17-R19 R34-R37 R39-R45 R47 R48 R51-R54 R59-R62 R64 R65 = R_0603_EU: Contributor: LCEDA_Lib
RN1-RN6 RN19 RN20 RN23 RN27 RN28 RN31 RN32 = 4D03WGJ0102T5E: Supplier: LCSC; Manufacturer: UniOhm; Supplier Part: C20197; SMT Type: Basic; JLCPCB SMD: Yes; LCSC Assembly: Yes
RN7 RN8 RN12-RN14 RN17 RN18 = 4D03WGJ0103T5E: Supplier: LCSC; Manufacturer: UniOhm; Supplier Part: C29718; SMT Type: Basic; JLCPCB SMD: Yes; LCSC Assembly: Yes
RN9-RN11 RN15 RN16 RN21 RN22 RN24-RN26 RN29 RN30 = 4D03WGJ0472T5E: Supplier: LCSC; Manufacturer: UniOhm; Supplier Part: C1980; SMT Type: Basic; JLCPCB SMD: Yes; LCSC Assembly: Yes
U5-U7 U18 = 74HC595D,118: Supplier: LCSC; Manufacturer: Nexperia; image: //image.lceda.cn/szlcsc/C5947.jpg; Supplier Part: C5947; SMT Type: Basic; JLCPCB SMD: Yes; LCSC Assembly: Yes
U8-U10 = 74HC165D,653: Supplier: LCSC; Manufacturer: Nexperia; image: //image.lceda.cn/szlcsc/C5613.jpg; Supplier Part: C5613; SMT Type: Basic; JLCPCB SMD: Yes; LCSC Assembly: Yes
H11 H12 = A2541WV-2X4P: Supplier: LCSC; Supplier Part: C225519; Manufacturer: Changjiang Connectors; Manufacturer Part: A2541WV-2x4P; Contributor: LCSC; LCSC Assembly: Yes; SMT Type: Extend
R26-R29 R55 R56 = 0603WAF1003T5E: Supplier: LCSC; Manufacturer: UniOhm; Supplier Part: C25803; SMT Type: Basic; JLCPCB SMD: Yes; LCSC Assembly: Yes
U4 = 74HC245D,653: Supplier: LCSC; Manufacturer: Nexperia; image: //image.lceda.cn/szlcsc/C5625.jpg; Supplier Part: C5625; SMT Type: Basic; JLCPCB SMD: Yes; LCSC Assembly: Yes
U12 U15 = LM358-Amplifier_Operational-ARU-rescue: Contributor: Михаил Кузнецов; subpart_no: 1; Manufacturer: ON; Supplier: LCSC; Supplier Part: C7955
U14 = LM358-Amplifier_Operational-ARU-rescue-ARU-rescue: Contributor: Михаил Кузнецов; subpart_no: 1; Manufacturer: ON; Supplier: LCSC; Supplier Part: C7955
U17 = 74HC08D,653: Supplier: LCSC; Manufacturer: Nexperia; image: //image.lceda.cn/szlcsc/C5593.jpg; Supplier Part: C5593; SMT Type: Basic; JLCPCB SMD: Yes; LCSC Assembly: Yes
5V 12V = 0603White light_C2290: Supplier: LCSC; Manufacturer: KENTO; Manufacturer Part: 0603White light; image: //image.lceda.cn/szlcsc/C2290.jpg; Supplier Part: C2290; SMT Type: Basic; JLCPCB SMD: Yes; LCSC Assembly: Yes
C2 C36 = CL10A105KP8NNNC: Supplier: LCSC; Manufacturer: SAMSUNG; Supplier Part: C26413
C12-C14 = CL10A226MQ8NRNC: Supplier: LCSC; Manufacturer: SAMSUNG; Supplier Part: C59461; SMT Type: Basic; JLCPCB SMD: Yes; LCSC Assembly: Yes
C15 = CL21A226MAQNNNE: Supplier: LCSC; Manufacturer: SAMSUNG; Supplier Part: C45783; SMT Type: Basic; JLCPCB SMD: Yes; LCSC Assembly: Yes
D1 D4 = SS34_C8678: Supplier: LCSC; Manufacturer Part: SS34; Manufacturer: MDD; image: //image.lceda.cn/szlcsc/C8678.jpg; Supplier Part: C8678; SMT Type: Basic; JLCPCB SMD: Yes; LCSC Assembly: Yes
D2 = SMCJ15CA_C310017: Supplier: LCSC; Supplier Part: C310017; Manufacturer: Brightking Elec (TAIWAN); Contributor: LCSC; SMT Type: Extend; JLCPCB SMD: Yes
D5 D6 = CDSOT23-T24CAN: Supplier: LCSC; Supplier Part: C252430; Manufacturer: Yenji Elec; Contributor: LCSC; LCSC Assembly: Yes; SMT Type: Extend
L1 = SWPA6028S6R8MT: Supplier: LCSC; Manufacturer: Sunlord; Supplier Part: C42261; SMT Type: Extend; JLCPCB SMD: Yes
LED1 = KT-0603R: Supplier: LCSC; Manufacturer: KENTO; image: //image.lceda.cn/szlcsc/C2286.jpg; Supplier Part: C2286; SMT Type: Basic; JLCPCB SMD: Yes; LCSC Assembly: Yes
ON TERM = A2541WV-2P: Supplier: LCSC; Supplier Part: C225477; Manufacturer: CJT(Changjiang Connectors); Contributor: LCSC; LCSC Assembly: Yes; SMT Type: Extend
R57 = 0805W8F1200T5E: Supplier: LCSC; Manufacturer: UniOhm; Supplier Part: C17437; SMT Type: Basic; JLCPCB SMD: Yes; LCSC Assembly: Yes
R38 R49 R66-R69 = RTT03102JTP: Supplier: LCSC; Manufacturer: RALEC; Supplier Part: C103209
RX232 RX485 RXCAN = 19-217/GHC-YR1S2/3T: Supplier: LCSC; Manufacturer: EVERLIGHT; image: //image.lceda.cn/szlcsc/C72043.jpg; Supplier Part: C72043; SMT Type: Basic; JLCPCB SMD: Yes; LCSC Assembly: Yes
U3 = TPS54331DR: Supplier: LCSC; Manufacturer: TI; image: //image.lceda.cn/szlcsc/C9865.jpg; Supplier Part: C9865; SMT Type: Basic; JLCPCB SMD: Yes; LCSC Assembly: Yes
U13 = SP485EEN-L/TR: Supplier: LCSC; Manufacturer: EXAR; Supplier Part: C6855; SMT Type: Basic; JLCPCB SMD: Yes; LCSC Assembly: Yes
U16 = TJA1050T/CM,118: Supplier: LCSC; Manufacturer: NXP; image: //image.lceda.cn/szlcsc/C6952.jpg; Supplier Part: C6952; SMT Type: Basic; JLCPCB SMD: Yes; LCSC Assembly: Yes
D3 D7 = B5819W_C8598: Supplier: LCSC; Manufacturer: CJ; Manufacturer Part: B5819W; image: //image.lceda.cn/szlcsc/C8598.jpg; Supplier Part: C8598; SMT Type: Basic; JLCPCB SMD: Yes; LCSC Assembly: Yes
J2 = A2541WV-2X2P: Supplier: LCSC; Supplier Part: C225517; Manufacturer: Changjiang Connectors; Manufacturer Part: A2541WV-2x2P; Contributor: LCSC
QWIIC1 = QWIIC SMD JST: Manufacturer: JST Sales America; Manufacturer Part: SM04B-SRSS-TB(LF)(SN); Supplier: LCSC; Supplier Part: C160404; link: https://www.sparkfun.com/products/14417; Contributor: donhagen
SERIAL1 = A2541WV-4P: Supplier: LCSC; Supplier Part: C225479; Manufacturer: Changjiang Connectors; Contributor: LCSC
U2 = USR-ES1: Manufacturer: USRIOT; link: https://www.usriot.com/download/ES1/USR-ES1-EN%20V1.3.pdf; Contributor: tomaz.dezman_0109
U11 = ESP32: Contributor: Bardssss; link: https://www.espressif.com/en/products/hardware/esp32-devkitc/overview

## Nets
+3V3: C32.2 D7.1(-) QWIIC1.2(3.3V) R1.1 R20.2 R21.2 U2.10(VIN33) U2.11(VIN33) U11.1(3v3)
+5V: 5V.1(A) C2.1 C10.1 C12.2 C13.2 C14.2 C21.1 C25.1 C26.1 C27.1 C28.1 C29.1 C36.1 H1.1 H2.1 H3.1 H4.1 H5.1 H6.1 H11.7 H12.7 L1.2 P7.1(VDD) R22.2 R23.2 R39.1 R48.2 R68.1 RN22.5 RN23.5 RN23.6 RN23.7 RN23.8 RN24.8 RN25.8 RN26.5 RN28.8 RN29.5 RN30.8 RN31.5 RN31.6 RN31.7 RN31.8 RN32.5 RN32.6 RN32.7 RN32.8 RX232.1(A) RX485.1(A) SERIAL1.1 TP34.1 TP36.1 TP38.1 TP40.1 TP41.1 TP43.1 TP46.1 TP48.1 TP49.1 TP51.1 TP53.1 TP55.1 TP57.1 TP59.1 TP61.1 TP63.1 TX232.1(A) TX485.1(A) TXCAN.1(A) U4.20(VCC) U5.10(MR#) U5.16(VCC) U6.10(MR#) U6.16(VCC) U7.10(MR#) U7.16(VCC) U8.16(VCC) U9.16(VCC) U10.16(VCC) U11.19(5V) U13.8(VCC) U16.3(VCC) U17.14(VCC) U18.10(MR#) U18.16(VCC)
+Vin: C7.1 C8.1 C9.1 C15.2 C20.1 D4.1(K) ON.1 Q1.3(C) Q2.3(C) Q3.3(C) Q4.3(C) Q5.3(C) U1.8(V+) U3.2(VIN) U12.8(V+) U14.8(V+) U15.8(V+)
GND: AIN1.2(C) AIN2.2(C) AIN3.2(C) AIN4.2(C) AOUT.2(C) C1.1 C2.2 C3.1 C4.1 C5.1 C6.1 C7.2 C8.2 C9.2 C10.2 C11.1 C12.1 C13.1 C14.1 C15.1 C16.2 C17.2 C18.2 C19.2 C20.2 C21.2 C22.1 C23.1 C25.2 C26.2 C27.2 C28.2 C29.2 C30.1 C36.2 CAN.2 D1.2(A) D2.1(K) D5.3 D6.3 DO0.2(C) DO1.2(C) DO2.2(C) DO3.2(C) DO4.2(C) DO5.2(C) DO6.2(C) H7.2 H8.2 H9.2 H10.2 H11.8 H12.8 P1.2 P2.2 P3.2 P4.2 P5.2 P6.2 P7.2(GND) P7.5(ADDR) POWER.1 POWER.2 QWIIC1.1(GND) QWIIC1.5(NC1) QWIIC1.6(NC2) R17.1 R18.1 R31.2 R34.1 R37.2 R40.1 R42.1 R45.1 R51.1 R52.1 R53.1 R54.1 R65.1 RN9.1 RN9.2 RN9.3 RN9.4 RN10.1 RN10.2 RN10.3 RN10.4 RN11.1 RN11.2 RN11.3 RN11.4 RN15.1 RN15.2 RN15.3 RN15.4 RN16.1 RN16.2 RN16.3 RN16.4 RN21.1 RN21.2 RN21.3 RN21.4 RN22.1 RN22.6 RN24.4 RN24.7 RN25.4 RN25.7 RN26.1 RN26.6 RN28.7 RN29.1 RN29.6 RN30.4 RN30.7 RS485.2 SERIAL1.2 TP33.1 TP35.1 TP37.1 TP39.1 TP42.1 TP44.1 TP45.1 TP47.1 TP50.1 TP52.1 TP54.1 TP56.1 TP58.1 TP60.1 TP62.1 TP64.1 U1.4(V-) U2.1(GND) U2.2(GND) U2.9(PWDN) U2.12(GND) U3.7(GND) U4.1(DIR) U4.10(GND) U4.18(B0) U5.8(GND) U6.8(GND) U7.8(GND) U8.8(GND) U8.15(CE#) U9.8(GND) U9.10(DS) U9.15(CE#) U10.8(GND) U10.15(CE#) U11.14(GND) U11.32(GND) U11.38(GND) U12.4(V-) U13.5(GND) U14.4(V-) U15.4(V-) U16.2(GND) U16.8(S) U17.7(GND) U18.8(GND)
(TxD): H13.3 U11.35(IO1)
+Batt: CAN.1 D2.2(A) D4.2(A) H1.3 H2.3 H3.3 H4.3 H5.3 H6.3 LED1.2(K) POWER.3 POWER.4 RS485.1 TP65.1 TP67.1 TP69.1 TP71.1 TP74.1 TP76.1 TP78.1 TP80.1 TP81.1 TP83.1 TP85.1 TP87.1 TP89.1 TP91.1 TP93.1 TP95.1
_CS_DIO: U5.11(SHCP) U6.11(SHCP) U7.11(SHCP) U8.1(PL#) U9.1(PL#) U10.1(PL#) U11.23(IO15) U18.11(SHCP)
_CS_Eth: H13.1 U2.5(nSS) U11.29(IO5)
_OE: C32.1 R1.2 R46.1 U4.19(OE) U5.13(OE#) U6.13(OE#) U7.13(OE#) U18.13(OE#)
A: D6.2 R48.1 RS485.3 TERM.1 U13.6(A)
A0: C1.2 P7.7(A0) R3.1 R4.2
A1: C3.2 P7.8(A1) R8.1 R12.2
A2: C5.2 P7.9(A2) R9.1 R13.2
A3: C6.2 P7.10(A3) R11.1 R15.2
Ain0: Q1.1(B) R3.2 R5.2 TP145.1 TP146.1 TP147.1 TP148.1 TP149.1 TP150.1 TP151.1 TP152.1 TP155.1 TP156.1
Ain1: Q2.1(B) R8.2 R16.2 TP273.1 TP274.1 TP275.1 TP276.1 TP277.1 TP278.1 TP279.1 TP280.1 TP281.1 TP282.1 TP283.1 TP284.1 TP286.1 TP287.1 TP288.1
Ain2: Q3.1(B) R9.2 R24.2 TP253.1 TP254.1 TP255.1 TP256.1 TP257.1 TP258.1 TP259.1 TP260.1 TP261.1 TP262.1 TP263.1 TP264.1 TP265.1 TP266.1 TP267.1 TP268.1 TP269.1 TP270.1 TP271.1 TP272.1
Ain3: Q4.1(B) R11.2 R25.2 TP401.1 TP402.1 TP403.1 TP404.1 TP405.1 TP406.1 TP407.1 TP408.1 TP409.1 TP410.1 TP411.1 TP412.1 TP413.1 TP414.1 TP415.1 TP416.1 TP417.1 TP418.1 TP419.1 TP420.1 TP421.1 TP422.1 TP423.1 TP424.1 TP428.1
Ain4: H11.5 H11.6 R51.2 RN12.1 TP197.1 TP201.1 TP202.1 TP203.1 TP204.1 TP205.1 TP206.1 TP207.1 TP208.1
Ain5: H12.5 H12.6 R52.2 RN12.2 TP321.1 TP322.1 TP325.1 TP326.1 TP327.1 TP328.1 TP329.1 TP330.1 TP331.1 TP332.1 TP333.1 TP334.1 TP335.1 TP336.1
Ain6: R53.2 RN12.3 TP209.1 TP210.1 TP211.1 TP212.1 TP213.1 TP214.1 TP215.1 TP216.1 TP217.1 TP218.1 TP219.1 TP220.1 TP221.1 TP222.1 TP223.1 TP224.1 TP226.1 TP227.1 TP228.1
Ain7: R54.2 RN12.4 TP441.1 TP442.1 TP443.1 TP444.1 TP445.1 TP446.1 TP447.1 TP448.1 TP449.1 TP450.1 TP451.1 TP452.1 TP453.1 TP454.1 TP455.1 TP456.1 TP457.1 TP458.1 TP459.1 TP460.1 TP461.1 TP462.1 TP463.1 TP464.1
Aout: C4.2 Q5.1(B) R33.1 TP337.1 TP338.1 TP339.1 TP340.1 TP341.1 TP342.1 TP343.1 TP344.1 TP345.1 TP346.1 TP347.1 TP348.1 TP349.1 TP350.1 TP351.1 TP352.1 TP353.1 TP354.1 TP355.1 TP356.1 TP357.1 TP358.1 TP359.1 TP360.1 TP361.1 TP362.1 TP363.1 TP364.1 TP368.1
B: D6.1 R37.1 R57.1 RS485.4 U13.7(B)
CANH: CAN.4 D5.1 U16.7(CANH)
CANL: CAN.3 D5.2 U16.6(CANL)
D20: P3.7 RN6.5
D21: P3.8 RN6.6
D22: P3.9 RN6.7
D23: P3.10 RN6.8
DAC: R32.2 U11.10(IO26)
DI0: DIN0.2(C) R27.2 U11.7(IO32) U12.1
DI1: DIN1.2(C) R26.2 U11.8(IO33) U12.7
DI2: DIN2.2(C) R28.2 U11.12(IO14) U15.1
DI3: DIN3.2(C) R29.2 U11.13(IO12) U15.7
DI4: DIN4.2(C) J2.1 R47.2 R56.2 U14.1
DI4/DO1: R47.1 U4.12(B6) U11.15(IO13)
DI5: DIN5.2(C) J2.3 R55.2 U14.7
Din0: RN24.5 RN24.6 TP137.1 TP141.1 TP142.1 TP143.1 TP144.1
Din1: RN22.7 RN22.8 TP73.1 TP75.1 TP77.1 TP79.1 TP82.1 TP84.1 TP86.1 TP88.1 TP90.1 TP92.1 TP94.1 TP96.1 TP97.1 TP98.1 TP99.1 TP100.1 TP101.1 TP102.1 TP103.1 TP104.1 TP105.1 TP106.1 TP107.1 TP108.1 TP109.1 TP110.1 TP111.1 TP112.1
Din2: RN25.5 RN25.6 TP177.1 TP178.1 TP179.1 TP180.1 TP181.1 TP182.1 TP183.1 TP184.1 TP185.1 TP186.1 TP187.1 TP188.1 TP189.1 TP190.1 TP191.1 TP192.1 TP193.1 TP194.1 TP195.1 TP196.1 TP198.1 TP199.1 TP200.1
Din3: RN26.7 RN26.8 TP305.1 TP306.1 TP307.1 TP308.1 TP309.1 TP310.1 TP311.1 TP312.1 TP313.1 TP314.1 TP315.1 TP316.1 TP317.1 TP318.1 TP319.1 TP320.1 TP323.1 TP324.1
Din4: RN30.5 RN30.6 TP225.1 TP229.1 TP230.1 TP231.1 TP232.1 TP233.1 TP234.1 TP235.1 TP236.1 TP237.1 TP238.1 TP239.1 TP240.1
Din5: RN29.7 RN29.8 TP433.1 TP434.1 TP435.1 TP436.1 TP437.1 TP438.1 TP439.1 TP440.1
DO0: H13.2 U4.11(B7)
DO2: H12.3 U4.13(B5) U18.15(Q0)
DO3: H12.4 U4.14(B4) U18.1(Q1)
DO4: U4.15(B3) U17.2(1B) U18.4(Q4)
Dout0: RN28.5 TP66.1 TP68.1 TP70.1 TP72.1
Dout1: RN27.7 TP113.1 TP114.1 TP115.1 TP116.1 TP117.1 TP118.1 TP119.1 TP120.1 TP121.1 TP122.1 TP123.1 TP124.1 TP125.1 TP126.1 TP127.1 TP128.1 TP129.1 TP130.1 TP131.1 TP132.1 TP133.1 TP134.1 TP135.1 TP136.1 TP138.1 TP139.1 TP140.1
Dout2: RN27.5 TP153.1 TP154.1 TP157.1 TP158.1 TP159.1 TP160.1 TP161.1 TP162.1 TP163.1 TP164.1 TP165.1 TP166.1 TP167.1 TP168.1 TP169.1 TP170.1 TP171.1 TP172.1 TP173.1 TP174.1 TP175.1 TP176.1
Dout3: RN20.7 TP285.1 TP289.1 TP290.1 TP291.1 TP292.1 TP293.1 TP294.1 TP295.1 TP296.1 TP297.1 TP298.1 TP299.1 TP300.1 TP301.1 TP302.1 TP303.1 TP304.1
Dout4: RN20.5 TP241.1 TP242.1 TP243.1 TP244.1 TP245.1 TP246.1 TP247.1 TP248.1 TP249.1 TP250.1 TP251.1 TP252.1
Dout5: RN19.7 TP425.1 TP426.1 TP427.1 TP429.1 TP430.1 TP431.1 TP432.1
Dout6: RN19.5 TP365.1 TP366.1 TP367.1
EN_1.24: R40.2 R44.1 U3.3(EN)
FB_.8V: R34.2 R39.2 U3.5(VSENSE)
MISO: R43.1 U10.9(Q7)
MISO3: R43.2 R45.2 U2.7(MISO) U11.31(IO19)
MOSI: U2.3(MOSI) U5.14(DS) U11.37(IO23)
MOSI&#039;: U7.9(Q7S)
MOSI': U18.14(DS)
OE485: R46.2 U11.25(IO0) U13.2(RE#) U13.3(DE)
PWM0: U4.17(B1) U11.24(IO2) U17.1(1A) U17.4(2A)
PWM1: U4.16(B2) U11.26(IO4) U17.9(3A) U17.12(4A)
RxD232: D3.1(-) R49.2 SERIAL1.3
RxD485: R19.1 R66.2 U13.1(RO)
RxDCAN: R41.1 RXCAN.2(C) U16.4(RXD)
SCL: P7.3(SCL) QWIIC1.4(SCL) R20.1 R23.1 U11.36(IO22)
SCLK: U2.4(SCLK) U5.12(STCP) U6.12(STCP) U7.12(STCP) U8.2(CP) U9.2(CP) U10.2(CP) U11.30(IO18) U18.12(STCP)
SDA: P7.4(SDA) QWIIC1.3(SDA) R21.1 R22.1 U11.33(IO21)
SS: C11.2 U3.4(SS)
SW!: C24.2 D1.1(K) L1.1 U3.8(PH)
TxD: R38.2 R67.2 SERIAL1.4 U11.28(IO17) U13.4(DI)
TxDCAN: D7.2(+) R68.2 R69.2 RXCAN.1(A) U11.11(IO27) U16.1(TXD)
Net-(5V-2): 5V.2(K) R42.2
Net-(12V-1): 12V.1(A) ON.2
Net-(12V-2): 12V.2(K) R44.2
Net-(AIN1-1): AIN1.1(A) R6.1
Net-(AIN2-1): AIN2.1(A) R7.1
Net-(AIN3-1): AIN3.1(A) R10.1
Net-(AIN4-1): AIN4.1(A) R14.1
Net-(AOUT-1): AOUT.1(A) R50.1
Net-(C16-1): C16.1 RN12.8 U11.6(IO35)
Net-(C17-1): C17.1 RN12.7 U11.5(IO34)
Net-(C18-1): C18.1 J2.4 RN12.6 U11.4(IO39)
Net-(C19-1): C19.1 J2.2 RN12.5 U11.3(IO36)
Net-(C22-2): C22.2 R35.1 R36.1 U3.6(COMP)
Net-(C23-2): C23.2 R35.2 R36.2
Net-(C24-1): C24.1 U3.1(BOOT)
Net-(C30-2): C30.2 R32.1 U1.3(+)
Net-(C31-1): C31.1 R30.1 R33.2 U1.1
Net-(C31-2): C31.2 R30.2 R31.1 U1.2(-)
Net-(CN3-1): CN3.1 TP1.1
Net-(CN3-2): CN3.2 TP2.1
Net-(CN3-3): CN3.3 TP3.1
Net-(CN3-4): CN3.4 TP4.1
Net-(CN4-1): CN4.1 TP5.1
Net-(CN4-2): CN4.2 TP6.1
Net-(CN4-3): CN4.3 TP7.1
Net-(CN4-4): CN4.4 TP8.1
Net-(CN5-1): CN5.1 TP13.1
Net-(CN5-2): CN5.2 TP14.1
Net-(CN5-3): CN5.3 TP15.1
Net-(CN5-4): CN5.4 TP16.1
Net-(CN6-1): CN6.1 TP9.1
Net-(CN6-2): CN6.2 TP10.1
Net-(CN6-3): CN6.3 TP11.1
Net-(CN6-4): CN6.4 TP12.1
Net-(CN7-1): CN7.1 TP28.1
Net-(CN7-2): CN7.2 TP27.1
Net-(CN7-3): CN7.3 TP26.1
Net-(CN7-4): CN7.4 TP25.1
Net-(CN8-1): CN8.1 TP32.1
Net-(CN8-2): CN8.2 TP31.1
Net-(CN8-3): CN8.3 TP30.1
Net-(CN8-4): CN8.4 TP29.1
Net-(CN9-1): CN9.1 TP24.1
Net-(CN9-2): CN9.2 TP23.1
Net-(CN9-3): CN9.3 TP22.1
Net-(CN9-4): CN9.4 TP21.1
Net-(CN10-1): CN10.1 TP20.1
Net-(CN10-2): CN10.2 TP19.1
Net-(CN10-3): CN10.3 TP18.1
Net-(CN10-4): CN10.4 TP17.1
Net-(D3-2): D3.2(+) R18.2 R19.2 U11.27(IO16)
Net-(DIN0-1): DIN0.1(A) RN32.3
Net-(DIN1-1): DIN1.1(A) RN32.1
Net-(DIN2-1): DIN2.1(A) RN23.3
Net-(DIN3-1): DIN3.1(A) RN23.1
Net-(DIN4-1): DIN4.1(A) RN31.3
Net-(DIN5-1): DIN5.1(A) RN31.1
Net-(DO0-1): DO0.1(A) RN28.6
Net-(DO1-1): DO1.1(A) RN27.8
Net-(DO2-1): DO2.1(A) RN27.6
Net-(DO3-1): DO3.1(A) RN20.8
Net-(DO4-1): DO4.1(A) RN20.6
Net-(DO5-1): DO5.1(A) RN19.8
Net-(DO6-1): DO6.1(A) RN19.6
Net-(H1-2): H1.2 R64.2
Net-(H2-2): H2.2 R2.2
Net-(H3-2): H3.2 R62.2
Net-(H4-2): H4.2 R59.2
Net-(H5-2): H5.2 R60.2
Net-(H6-2): H6.2 R61.2
Net-(H7-1): H7.1 R5.1
Net-(H7-3): H7.3 R4.1
Net-(H8-1): H8.1 R16.1
Net-(H8-3): H8.3 R12.1
Net-(H9-1): H9.1 R24.1
Net-(H9-3): H9.3 R13.1
Net-(H10-1): H10.1 R25.1
Net-(H10-3): H10.3 R15.1
Net-(H11-1): H11.1 U17.8(3Y)
Net-(H11-2): H11.2 U17.11(4Y)
Net-(H11-3): H11.3 U18.2(Q2)
Net-(H11-4): H11.4 U18.3(Q3)
Net-(H12-1): H12.1 U17.3(1Y)
Net-(H12-2): H12.2 U17.6(2Y)
Net-(LED1-1): LED1.1(A) R65.2
Net-(P1-1): P1.1 R64.1
Net-(P1-3): P1.3 RN1.5
Net-(P1-4): P1.4 RN1.6
Net-(P1-5): P1.5 RN1.7
Net-(P1-6): P1.6 RN1.8
Net-(P1-7): P1.7 RN2.5
Net-(P1-8): P1.8 RN2.6
Net-(P1-9): P1.9 RN2.7
Net-(P1-10): P1.10 RN2.8
Net-(P2-1): P2.1 R2.1
Net-(P2-3): P2.3 RN3.5
Net-(P2-4): P2.4 RN3.6
Net-(P2-5): P2.5 RN3.7
Net-(P2-6): P2.6 RN3.8
Net-(P2-7): P2.7 RN4.5
Net-(P2-8): P2.8 RN4.6
Net-(P2-9): P2.9 RN4.7
Net-(P2-10): P2.10 RN4.8
Net-(P3-1): P3.1 R62.1
Net-(P3-3): P3.3 RN5.5
Net-(P3-4): P3.4 RN5.6
Net-(P3-5): P3.5 RN5.7
Net-(P3-6): P3.6 RN5.8
Net-(P4-1): P4.1 R59.1
Net-(P4-3): P4.3 RN7.7 RN10.6
Net-(P4-4): P4.4 RN7.8 RN10.5
Net-(P4-5): P4.5 RN7.5 RN10.8
Net-(P4-6): P4.6 RN7.6 RN10.7
Net-(P4-7): P4.7 RN8.7 RN9.6
Net-(P4-8): P4.8 RN8.8 RN9.5
Net-(P4-9): P4.9 RN8.5 RN9.8
Net-(P4-10): P4.10 RN8.6 RN9.7
Net-(P5-1): P5.1 R60.1
Net-(P5-3): P5.3 RN14.7 RN15.6
Net-(P5-4): P5.4 RN14.8 RN15.5
Net-(P5-5): P5.5 RN14.5 RN15.8
Net-(P5-6): P5.6 RN14.6 RN15.7
Net-(P5-7): P5.7 RN11.6 RN13.7
Net-(P5-8): P5.8 RN11.5 RN13.8
Net-(P5-9): P5.9 RN11.8 RN13.5
Net-(P5-10): P5.10 RN11.7 RN13.6
Net-(P6-1): P6.1 R61.1
Net-(P6-3): P6.3 RN18.7 RN21.6
Net-(P6-4): P6.4 RN18.8 RN21.5
Net-(P6-5): P6.5 RN18.5 RN21.8
Net-(P6-6): P6.6 RN18.6 RN21.7
Net-(P6-7): P6.7 RN16.6 RN17.7
Net-(P6-8): P6.8 RN16.5 RN17.8
Net-(P6-9): P6.9 RN16.8 RN17.5
Net-(P6-10): P6.10 RN16.7 RN17.6
Net-(Q1-2): Q1.2(E) R6.2
Net-(Q2-2): Q2.2(E) R7.2
Net-(Q3-2): Q3.2(E) R10.2
Net-(Q4-2): Q4.2(E) R14.2
Net-(Q5-2): Q5.2(E) R50.2
Net-(R17-2): R17.2 R41.2 U11.9(IO25)
Net-(R26-1): R26.1 RN22.3 RN22.4 U12.5(+)
Net-(R27-1): R27.1 RN24.1 RN24.2 U12.3(+)
Net-(R28-1): R28.1 RN25.1 RN25.2 U15.3(+)
Net-(R29-1): R29.1 RN26.3 RN26.4 U15.5(+)
Net-(R38-1): R38.1 TX232.2(C)
Net-(R49-1): R49.1 RX232.2(C)
Net-(R55-1): R55.1 RN29.3 RN29.4 U14.5(+)
Net-(R56-1): R56.1 RN30.1 RN30.2 U14.3(+)
Net-(R57-2): R57.2 TERM.2
Net-(R66-1): R66.1 RX485.2(C)
Net-(R67-1): R67.1 TX485.2(C)
Net-(R69-1): R69.1 TXCAN.2(C)
Net-(RN1-1): RN1.1 U5.3(Q3)
Net-(RN1-2): RN1.2 U5.2(Q2)
Net-(RN1-3): RN1.3 U5.1(Q1)
Net-(RN1-4): RN1.4 U5.15(Q0)
Net-(RN2-1): RN2.1 U5.7(Q7)
Net-(RN2-2): RN2.2 U5.6(Q6)
Net-(RN2-3): RN2.3 U5.5(Q5)
Net-(RN2-4): RN2.4 U5.4(Q4)
Net-(RN3-1): RN3.1 U6.3(Q3)
Net-(RN3-2): RN3.2 U6.2(Q2)
Net-(RN3-3): RN3.3 U6.1(Q1)
Net-(RN3-4): RN3.4 U6.15(Q0)
Net-(RN4-1): RN4.1 U6.7(Q7)
Net-(RN4-2): RN4.2 U6.6(Q6)
Net-(RN4-3): RN4.3 U6.5(Q5)
Net-(RN4-4): RN4.4 U6.4(Q4)
Net-(RN5-1): RN5.1 U7.3(Q3)
Net-(RN5-2): RN5.2 U7.2(Q2)
Net-(RN5-3): RN5.3 U7.1(Q1)
Net-(RN5-4): RN5.4 U7.15(Q0)
Net-(RN6-1): RN6.1 U7.7(Q7)
Net-(RN6-2): RN6.2 U7.6(Q6)
Net-(RN6-3): RN6.3 U7.5(Q5)
Net-(RN6-4): RN6.4 U7.4(Q4)
Net-(RN7-1): RN7.1 U9.14(D3)
Net-(RN7-2): RN7.2 U9.3(D4)
Net-(RN7-3): RN7.3 U9.13(D2)
Net-(RN7-4): RN7.4 U9.4(D5)
Net-(RN8-1): RN8.1 U9.12(D1)
Net-(RN8-2): RN8.2 U9.5(D6)
Net-(RN8-3): RN8.3 U9.11(D0)
Net-(RN8-4): RN8.4 U9.6(D7)
Net-(RN13-1): RN13.1 U8.12(D1)
Net-(RN13-2): RN13.2 U8.5(D6)
Net-(RN13-3): RN13.3 U8.11(D0)
Net-(RN13-4): RN13.4 U8.6(D7)
Net-(RN14-1): RN14.1 U8.14(D3)
Net-(RN14-2): RN14.2 U8.3(D4)
Net-(RN14-3): RN14.3 U8.13(D2)
Net-(RN14-4): RN14.4 U8.4(D5)
Net-(RN17-1): RN17.1 U10.12(D1)
Net-(RN17-2): RN17.2 U10.5(D6)
Net-(RN17-3): RN17.3 U10.11(D0)
Net-(RN17-4): RN17.4 U10.6(D7)
Net-(RN18-1): RN18.1 U10.14(D3)
Net-(RN18-2): RN18.2 U10.3(D4)
Net-(RN18-3): RN18.3 U10.13(D2)
Net-(RN18-4): RN18.4 U10.4(D5)
Net-(RN19-1): RN19.1 RN19.2 U4.4(A2)
Net-(RN19-3): RN19.3 RN19.4 U4.3(A1)
Net-(RN20-1): RN20.1 RN20.2 U4.6(A4)
Net-(RN20-3): RN20.3 RN20.4 U4.5(A3)
Net-(RN22-2): RN22.2 U12.6(-)
Net-(RN24-3): RN24.3 U12.2(-)
Net-(RN25-3): RN25.3 U15.2(-)
Net-(RN26-2): RN26.2 U15.6(-)
Net-(RN27-1): RN27.1 RN27.2 U4.8(A6)
Net-(RN27-3): RN27.3 RN27.4 U4.7(A5)
Net-(RN28-1): RN28.1 RN28.2 U1.6(-)
Net-(RN28-3): RN28.3 U1.5(+) U4.9(A7)
Net-(RN28-4): RN28.4 U1.7
Net-(RN29-2): RN29.2 U14.6(-)
Net-(RN30-3): RN30.3 U14.2(-)
Net-(U5-9): U5.9(Q7S) U6.14(DS)
Net-(U6-9): U6.9(Q7S) U7.14(DS)
Net-(U8-9): U8.9(Q7) U10.10(DS)
Net-(U8-10): U8.10(DS) U9.9(Q7)
Net-(U17-5): U17.5(2B) U18.5(Q5)
Net-(U17-10): U17.10(3B) U18.6(Q6)
Net-(U17-13): U17.13(4B) U18.7(Q7)

Not connected (* = marked no-connect by the designer): P7 6(ALRT)*; RN23 2* 4*; RN31 2* 4*; RN32 2* 4*; U2 6(nINT)* 8(nRESET)*; U4 2(A0)*; U8 7(Q7#)*; U9 7(Q7#)*; U10 7(Q7#)*; U11 2(EN)* 16(IO9)* 17(IO10)* 18(IO11)* 20(IO6)* 21(IO7)* 22(IO8)* 34(IO3)*; U16 5(VREF)*; U18 9(Q7S)*

## Notes on the sheets
sheet 1
- Inputs: yellow
  Outputs: orange
  SerialIn: green
  SerialOut: blue
  Power: white
  Error: red
- 24 Digital Inputs
- 24 Digital Outputs
sheet 2
- Inputs: yellow
  Outputs: orange
  SerialIn: green
  SerialOut: blue
  Power: white
  Error: red
- Option: CAN2.0
- Option: RS485 / ModbusRTU / WS2811
- Switch Mode Power Supply
sheet 3
- Inputs: yellow
  Outputs: orange
  SerialIn: green
  SerialOut: blue
  Power: white
  Error: red
- 16bit ADC
- 20mA
- 15V
- open=0..5V
- 20mA
- 15V
- open=0..5V
- 20mA
- 15V
- open=0..5V
- 20mA
- 15V
- open=0..5V
sheet 4
- Inputs: yellow
  Outputs: orange
  SerialIn: green
  SerialOut: blue
  Power: white
  Error: red
- L_IS
- R_IS
- L_EN
- LPWM
- RPWM
- R_EN
sheet 5
- Inputs: yellow
  Outputs: orange
  SerialIn: green
  SerialOut: blue
  Power: white
  Error: red
- Signals: Connect to plugs via 1kOhm
- Ain 0.. 3: 16 bit (ADS11145)
  Ain 4.. 7: 12 bit
  Din 0.. 5: fast
  Din 8..31: slow
  Dout 0.. 6: fast
  Dout 8..31: slow
- or: Connect 12V to plugs via fuse
- or: Connect 5V/0V to plugs with jumper
- 3.5mm industrial push-in connectors
sheet 6
- Optional Modules:
  - Ethernet (W5500)
  - RS232
  - 2 fast DO (12V)
  - ADS1115
- I/Os:
  - 24 DI
  - 24 DO
  - 6 fast precision DI
  - 7 fast DO
  - 4 precision AI (16bit @ ADS1115)
  - 4 AI (via ESP32)
  - 1 AO (via ESP32)
  - RS485/Modbus
  - CAN2.0
- ESP32
- USB: use IO29 for DO0
  Ethernet: use IO1 for DO0
- TxD
- RxD
- Bootstrap! 1
- Bootstrap! 0
- Bootstrap! 1
- Bootstrap! 0
- Bootstrap! 1
- QWIIC
- Option: Ethernet
- Distance e. g.: https://de.aliexpress.com/item/4001287816907.html
- RS232 e.g.: https://de.aliexpress.com/item/2054995985.html
- Option: RS232/Distance
- SM04B-SRSS-TB(LF)(SN)
- Sparkfunk part PRT-14417
